# Altium project Softcore_SA_P2_HW.PrjPcb
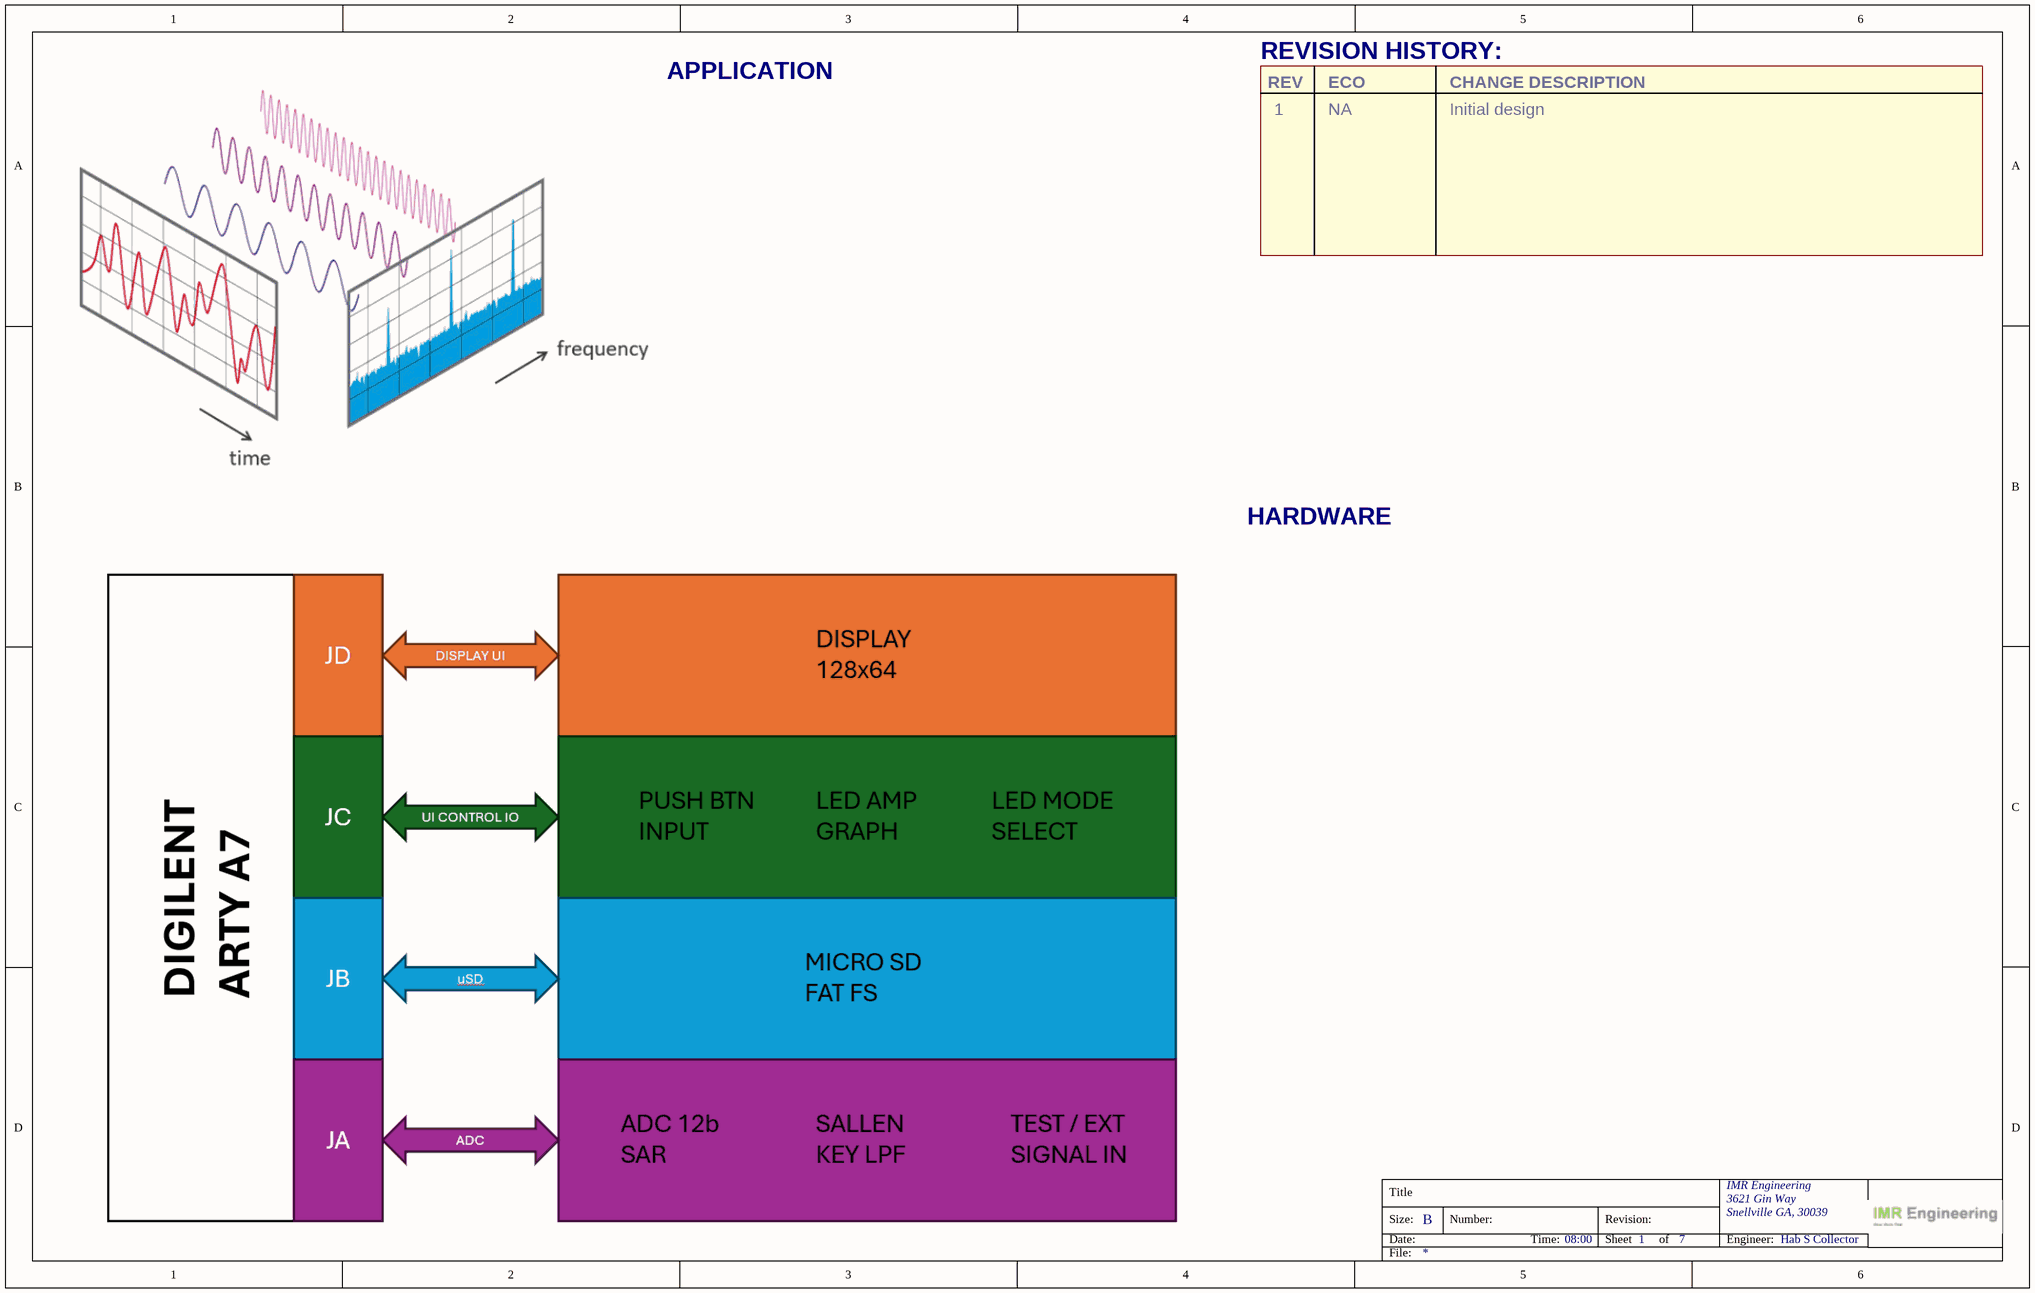
[diagram p0: SoftCore_SA_P2_PG1.SchDoc]
ProjectDate: 05/11/2026; ProjectDocumentNumber: IMR-107-SCH; ProjectRevision: 1; ProjectTime: 08:00; ProjectTitle: SoftCore_SA P2 Adapter
7 sheets, 204 parts. Net scope: flat (ports and power ports of the same name join across sheets).
Sheets:
  SoftCore_SA_P2_PG1.SchDoc
  SoftCore_SA_P2_PG2.SchDoc
  SoftCore_SA_P2_PG3.SchDoc
  SoftCore_SA_P2_PG4.SchDoc
  SoftCore_SA_P2_PG5.SchDoc
  SoftCore_SA_P2_PG6.SchDoc
  SoftCore_SA_P2_PG7.SchDoc

## Sheet SoftCore_SA_P2_PG1.SchDoc: =ProjectTitle
size B; Date: 05/11/2026; Engineer: Hab S Collector; Address1: 3621 Gin Way; Address2: Snellville GA, 30039; DocumentNumber: IMR-107-SCH; Revision: 1; SheetNumber: 1; SheetTotal: 7

### Notes on the sheet
- APPLICATION
- REVISION HISTORY:
- REV
- ECO
- CHANGE DESCRIPTION
- 1
- NA
- Initial design
- HARDWARE
- Title
- Size:
- Date:
- B
- Number:
- Time:
- Revision:
- Sheet
- of
- IMR Engineering
- Engineer:
- File:

## Sheet SoftCore_SA_P2_PG2.SchDoc: =ProjectTitle
size B; Date: 05/11/2026; Engineer: Hab S Collector; Address1: 3621 Gin Way; Address2: Snellville GA, 30039; DocumentNumber: IMR-107-SCH; Revision: 1; SheetNumber: 2; SheetTotal: 7
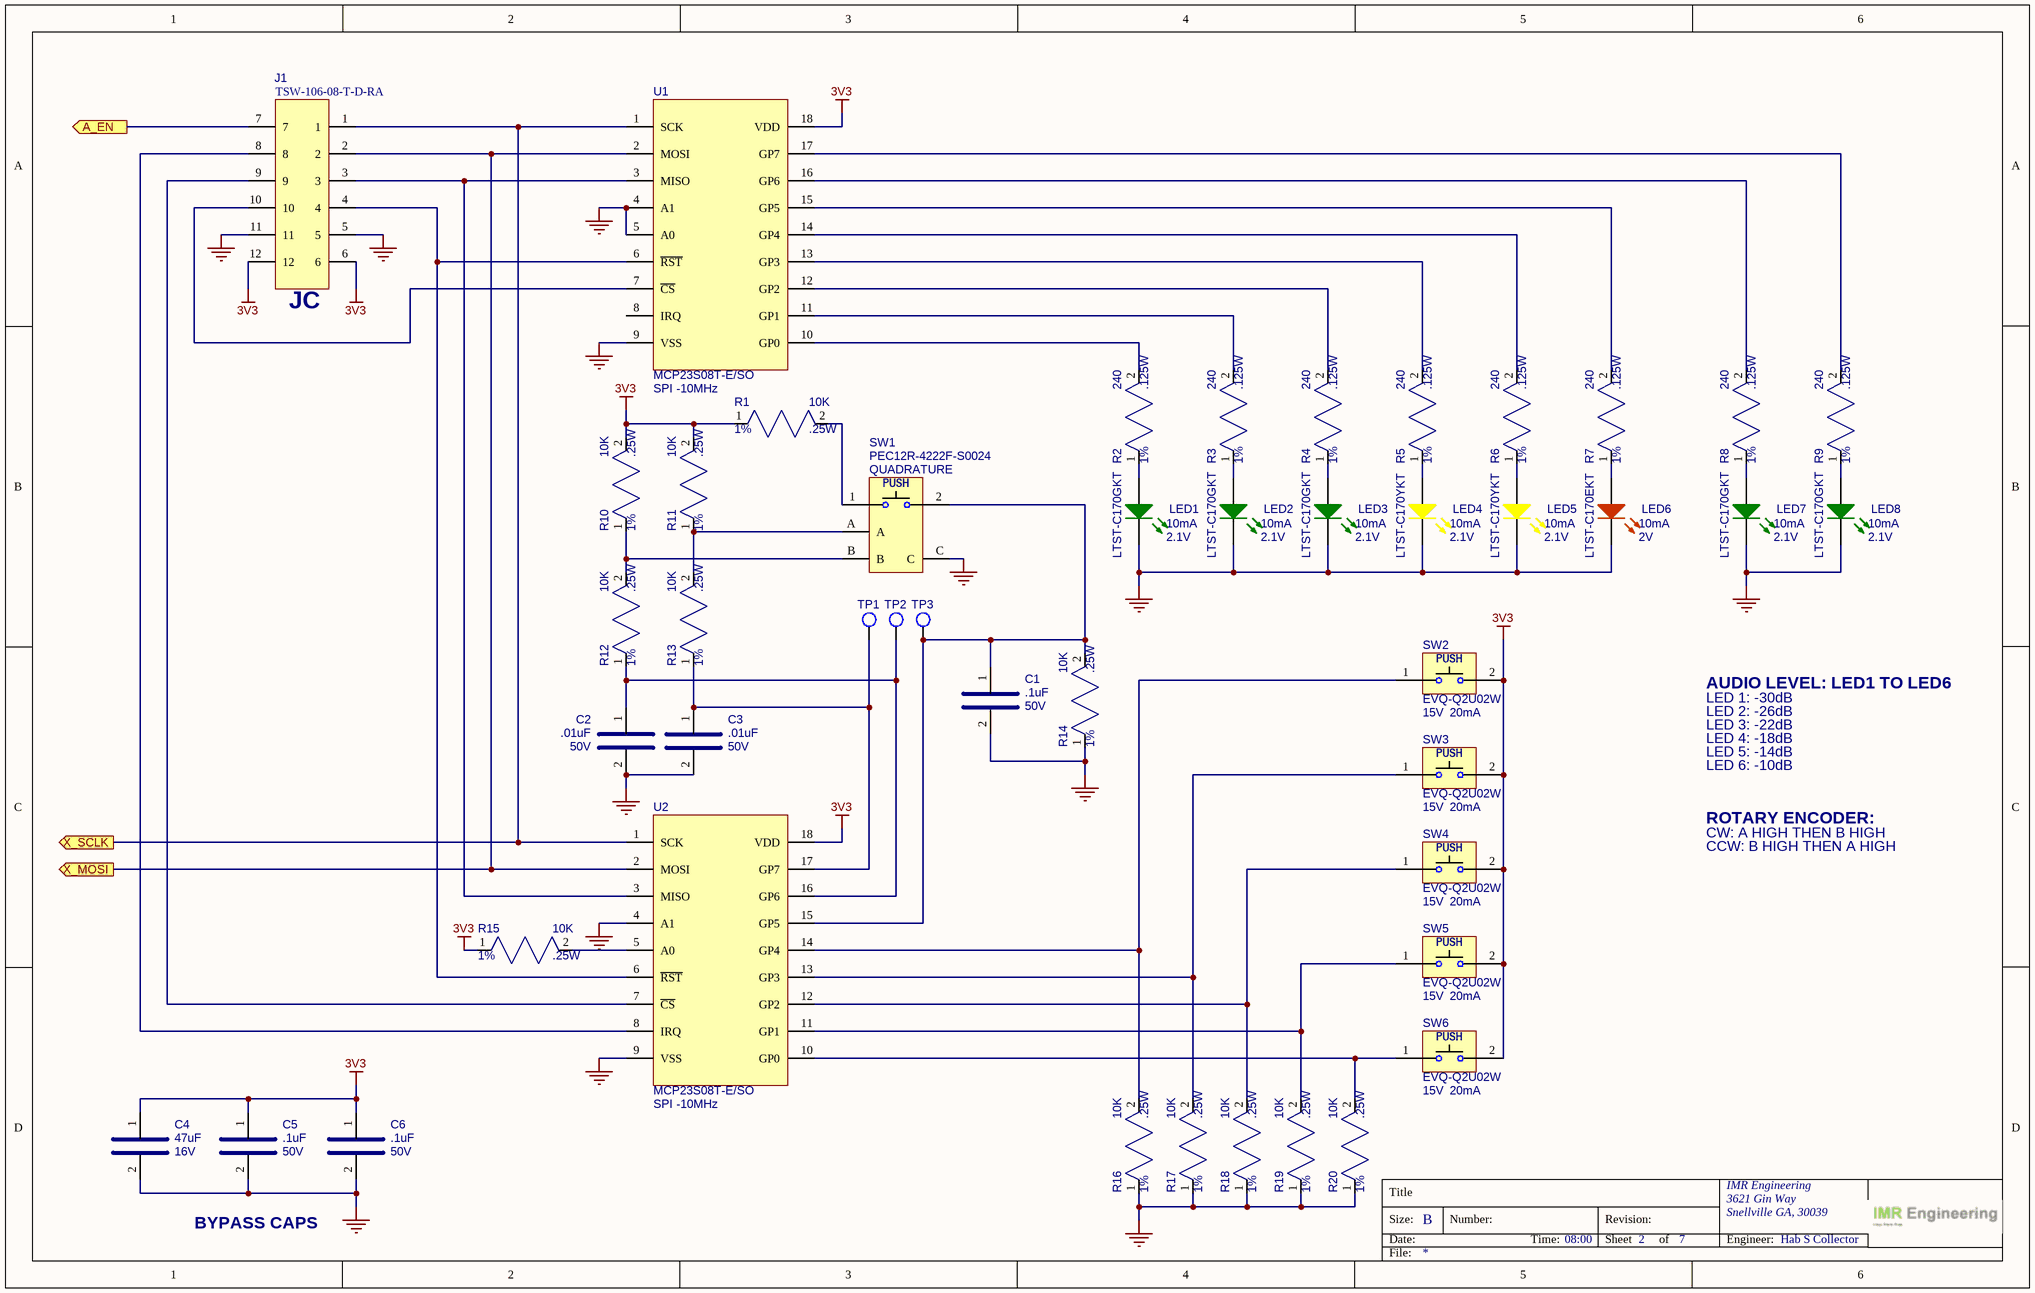
[diagram p1: SoftCore_SA_P2_PG2.SchDoc]

### Parts
C1  value .1uF  Voltage: 50V  [CAP_0805]  (hidden comment: KGM21NR71H104KT)
C2  value .01uF  Voltage: 50V  [CAP_0805]  (hidden comment: KGM21NR71H103KT)
C3  value .01uF  Voltage: 50V  [CAP_0805]  (hidden comment: KGM21NR71H103KT)
C4  value 47uF  Voltage: 16V  [CAP_1210]  (hidden comment: GRM32ER60J476ME20L)
C5  value .1uF  Voltage: 50V  [CAP_0805]  (hidden comment: KGM21NR71H104KT)
C6  value .1uF  Voltage: 50V  [CAP_0805]  (hidden comment: KGM21NR71H104KT)
J1  TSW-106-08-T-D-RA  [SAMTEC_TSW-106-08-T-D-RA]
LED1  value 2.1V  Current: 10mA  [LED_0805]  (hidden comment: LTST-C170GKT)
LED2  value 2.1V  Current: 10mA  [LED_0805]  (hidden comment: LTST-C170GKT)
LED3  value 2.1V  Current: 10mA  [LED_0805]  (hidden comment: LTST-C170GKT)
LED4  value 2.1V  Current: 10mA  [LED_0805]  (hidden comment: LTST-C170YKT)
LED5  value 2.1V  Current: 10mA  [LED_0805]  (hidden comment: LTST-C170YKT)
LED6  value 2V  Current: 10mA  [LED_0805]  (hidden comment: LTST-C170EKT)
LED7  value 2.1V  Current: 10mA  [LED_0805]  (hidden comment: LTST-C170GKT)
LED8  value 2.1V  Current: 10mA  [LED_0805]  (hidden comment: LTST-C170GKT)
R1  value 10K  Power: .25W  Tolerance: 1%  [RES_0805]  (hidden comment: RC0805FR-7W10KL)
R2  value 240  Power: .125W  Tolerance: 1%  [RES_0805]  (hidden comment: RC0805FR-13240RL)
R3  value 240  Power: .125W  Tolerance: 1%  [RES_0805]  (hidden comment: RC0805FR-13240RL)
R4  value 240  Power: .125W  Tolerance: 1%  [RES_0805]  (hidden comment: RC0805FR-13240RL)
R5  value 240  Power: .125W  Tolerance: 1%  [RES_0805]  (hidden comment: RC0805FR-13240RL)
R6  value 240  Power: .125W  Tolerance: 1%  [RES_0805]  (hidden comment: RC0805FR-13240RL)
R7  value 240  Power: .125W  Tolerance: 1%  [RES_0805]  (hidden comment: RC0805FR-13240RL)
R8  value 240  Power: .125W  Tolerance: 1%  [RES_0805]  (hidden comment: RC0805FR-13240RL)
R9  value 240  Power: .125W  Tolerance: 1%  [RES_0805]  (hidden comment: RC0805FR-13240RL)
R10  value 10K  Power: .25W  Tolerance: 1%  [RES_0805]  (hidden comment: RC0805FR-7W10KL)
R11  value 10K  Power: .25W  Tolerance: 1%  [RES_0805]  (hidden comment: RC0805FR-7W10KL)
R12  value 10K  Power: .25W  Tolerance: 1%  [RES_0805]  (hidden comment: RC0805FR-7W10KL)
R13  value 10K  Power: .25W  Tolerance: 1%  [RES_0805]  (hidden comment: RC0805FR-7W10KL)
R14  value 10K  Power: .25W  Tolerance: 1%  [RES_0805]  (hidden comment: RC0805FR-7W10KL)
R15  value 10K  Power: .25W  Tolerance: 1%  [RES_0805]  (hidden comment: RC0805FR-7W10KL)
R16  value 10K  Power: .25W  Tolerance: 1%  [RES_0805]  (hidden comment: RC0805FR-7W10KL)
R17  value 10K  Power: .25W  Tolerance: 1%  [RES_0805]  (hidden comment: RC0805FR-7W10KL)
R18  value 10K  Power: .25W  Tolerance: 1%  [RES_0805]  (hidden comment: RC0805FR-7W10KL)
R19  value 10K  Power: .25W  Tolerance: 1%  [RES_0805]  (hidden comment: RC0805FR-7W10KL)
R20  value 10K  Power: .25W  Tolerance: 1%  [RES_0805]  (hidden comment: RC0805FR-7W10KL)
SW1  Output: QUADRATURE  [PEC12R-4222F-S0024]  (hidden comment: PEC12R-4222F-S0024)
SW2  value 15V  Current: 20mA  [PANASONIC_EVQ-Q2U02W]  (hidden comment: EVQ-Q2U02W)
SW3  value 15V  Current: 20mA  [PANASONIC_EVQ-Q2U02W]  (hidden comment: EVQ-Q2U02W)
SW4  value 15V  Current: 20mA  [PANASONIC_EVQ-Q2U02W]  (hidden comment: EVQ-Q2U02W)
SW5  value 15V  Current: 20mA  [PANASONIC_EVQ-Q2U02W]  (hidden comment: EVQ-Q2U02W)
SW6  value 15V  Current: 20mA  [PANASONIC_EVQ-Q2U02W]  (hidden comment: EVQ-Q2U02W)
TP1  (no value)  [TEST_POINT_35MIL_TH]  (no BOM)
TP2  (no value)  [TEST_POINT_35MIL_TH]  (no BOM)
TP3  (no value)  [TEST_POINT_35MIL_TH]  (no BOM)
U1  value SPI -10MHz  [SOIC-18_300]  (hidden comment: MCP23S08T-E/SO)
U2  value SPI -10MHz  [SOIC-18_300]  (hidden comment: MCP23S08T-E/SO)

### Ports
A_EN (out), X_MOSI (out), X_SCLK (out)

### Nets
3V3: C4.1 C5.1 C6.1 J1.6 J1.12 R1.1 R10.2 R11.2 R15.1 SW2.2(B') SW3.2(B') SW4.2(B') SW5.2(B') SW6.2(B') U1.18(VDD) U2.18(VDD)
GND: C1.2 C2.2 C3.2 C4.2 C5.2 C6.2 J1.5 J1.11 LED1.K LED2.K LED3.K LED4.K LED5.K LED6.K LED7.K LED8.K R14.1 R16.1 R17.1 R18.1 R19.1 R20.1 SW1.C U1.4(A1) U1.5(A0) U1.9(VSS) U2.4(A1) U2.9(VSS)
NetC1_1: C1.1 R14.2 SW1.2(B') TP3.1 U2.15(GP5)
NetC2_1: C2.1 R12.1 TP2.1 U2.16(GP6)
NetC3_1: C3.1 R13.1 TP1.1 U2.17(GP7)
NetJ1_1: J1.1 U1.1(SCK) U2.1(SCK) ; port X_SCLK
NetJ1_2: J1.2 U1.2(MOSI) U2.2(MOSI) ; port X_MOSI
NetJ1_3: J1.3 U1.3(MISO) U2.3(MISO)
NetJ1_4: J1.4 U1.6(~{RST}) U2.6(~{RST})
NetJ1_7: J1.7 ; port A_EN
NetJ1_8: J1.8 U2.8(IRQ)
NetJ1_9: J1.9 U2.7(~{CS})
NetJ1_10: J1.10 U1.7(~{CS})
NetLED1_A: LED1.A R2.1
NetLED2_A: LED2.A R3.1
NetLED3_A: LED3.A R4.1
NetLED4_A: LED4.A R5.1
NetLED5_A: LED5.A R6.1
NetLED6_A: LED6.A R7.1
NetLED7_A: LED7.A R8.1
NetLED8_A: LED8.A R9.1
NetR1_2: R1.2 SW1.1(B)
NetR2_2: R2.2 U1.10(GP0)
NetR3_2: R3.2 U1.11(GP1)
NetR4_2: R4.2 U1.12(GP2)
NetR5_2: R5.2 U1.13(GP3)
NetR6_2: R6.2 U1.14(GP4)
NetR7_2: R7.2 U1.15(GP5)
NetR8_2: R8.2 U1.16(GP6)
NetR9_2: R9.2 U1.17(GP7)
NetR10_1: R10.1 R12.2 SW1.B
NetR11_1: R11.1 R13.2 SW1.A
NetR15_2: R15.2 U2.5(A0)
NetR16_2: R16.2 SW2.1(B) U2.14(GP4)
NetR17_2: R17.2 SW3.1(B) U2.13(GP3)
NetR18_2: R18.2 SW4.1(B) U2.12(GP2)
NetR19_2: R19.2 SW5.1(B) U2.11(GP1)
NetR20_2: R20.2 SW6.1(B) U2.10(GP0)

Not connected (* = marked no-connect by the designer): U1 8(IRQ)

### Notes on the sheet
- (near J1) JC
- AUDIO LEVEL: LED1 TO LED6
- LED 1: -30dB
- LED 2: -26dB
- LED 3: -22dB
- LED 4: -18dB
- LED 5: -14dB
- LED 6: -10dB
- ROTARY ENCODER:
- CW: A HIGH THEN B HIGH
- CCW: B HIGH THEN A HIGH
- BYPASS CAPS
- Title
- Size:
- Date:
- B
- Number:
- Time:
- Revision:
- Sheet
- of
- IMR Engineering
- Engineer:
- File:
- (in symbol SWITCH_EVQ-Q2U02W) PUSH
- (in symbol SWITCH_PEC12R-4222F-S0024) PUSH

### Library data of the parts
C1 C5 C6 = CAP_SMD_0.1UF_50V_0805: CAP CER 0.1UF 50V X7R 0805; MFG: KYOCERA AVX; Case/Package: 0805; MFG_PN: KGM21NR71H104KT; Supplier 1: DigiKey; Supplier Part Number 1: 478-KGM21NR71H104KTCT-ND; Unit Price: .1
C2 C3 = CAP_SMD_0.01UF_50V_0805: CAP CER 0.01UF 50V X7R 0805; MFG: KYOCERA AVX; Case/Package: 0805; MFG_PN: KGM21NR71H103KT; Supplier 1: DigiKey; Supplier Part Number 1: 478-KGM21NR71H103KTCT-ND; Unit Price: .1
C4 = CAP_SMD_47UF_16V_1210: CAP CER 47UF 50V X5R 1210; MFG: Murata Electronics; Case/Package: 1210; MFG_PN: GRM32ER60J476ME20L; Supplier 1: DigiKey; Supplier Part Number 1: 490-1887-1-ND; Unit Price: .28
J1 = CONN_HEADER_12P_100MIL_RA: CONN HEADER R/A 12POS 2.54MM; MFG: Samtec Inc.; Case/Package: 2P_2.54MM; Supplier 1: Digi-Key; Supplier Part Number 1: SAM1049-06-ND; Unit Price: .93; MFG_PN: TSW-106-08-T-D-RA
LED1-LED3 LED7 LED8 = LED_GREEN_LTST-C170GKT: LED GREEN CLEAR SMD; MFG: Lite-On; Case/Package: 0805; Supplier 1: DigiKey; Supplier Part Number 1: 160-1179-1-ND; Unit Price: .10; MFG_PN: LTST-C170GKT
LED4 LED5 = LED_YELLOW_LTST-C170YKT: LED YELLOW CLEAR SMD; MFG: Lite-On; Case/Package: 0805; Supplier 1: DigiKey; Supplier Part Number 1: 160-1175-1-ND; Unit Price: .15; MFG_PN: LTST-C170YKT
LED6 = LED_RED_LTST-C170EKT: LED RED CLEAR SMD; MFG: Lite-On; Case/Package: 0805; Supplier 1: DigiKey; Supplier Part Number 1: 160-1178-1-ND; Unit Price: .18; MFG_PN: LTST-C170EKT
R1 R10-R20 = RES_SMD_10K_0805_1/4W_1%: RES SMD 10K OHM 1% 1/4W 0805; MFG: Yageo; Case/Package: 0805; MFG_PN: RC0805FR-7W10KL; Supplier 1: DigiKey; Supplier Part Number 1: 13-RC0805FR-7W10KLCT-ND; Unit Price: .10
R2-R9 = RES_SMD_240_0805_1/8W_1%: RES SMD 240 OHM 1% 1/8W 0805; MFG: Yageo; Case/Package: 0805; MFG_PN: RC0805FR-13240RL; Supplier 1: DigiKey; Supplier Part Number 1: 13-RC0805FR-13240RLCT-ND; Unit Price: .1
SW1 = SWITCH_PEC12R-4222F-S0024: ENCODER INCRE QUAD HORIZN PC PIN; MFG: Bourns; Pulses: 24; Case/Package: PEC12R; Supplier 1: DigiKey; Supplier Part Number 1: PEC12R-4222F-S0024-ND; Unit Price: 1.72; MFG_PN: PEC12R-4222F-S0024
SW2-SW6 = SWITCH_EVQ-Q2U02W: SWITCH TACTILE SPST-NO 0.02A 15V; MFG: American Zettler; Case/Package: EVQQ2; Supplier 1: DigiKey; Supplier Part Number 1: P12954SCT-ND; Unit Price: .25; MFG_PN: EVQ-Q2U02W
TP1-TP3 = CONN_TEST_POINT_TH_PROBE_TIP: TEST POINT TH FITS DSO PROBE TIP
U1 U2 = IC_MCP23S08T-E/SO: IC IO XPNDR 10MHZ SPI 18SOIC; MFG: Microchip; Case/Package: SOIC-18-300; Supplier 1: DigiKey; Supplier Part Number 1: MCP23S08T-E/SOCT-ND; Unit Price: 1.54; MFG_PN: MCP23S08T-E/SO

## Sheet SoftCore_SA_P2_PG3.SchDoc: =ProjectTitle
size B; Date: 05/11/2026; Engineer: Hab S Collector; Address1: 3621 Gin Way; Address2: Snellville GA, 30039; DocumentNumber: IMR-107-SCH; Revision: 1; SheetNumber: 3; SheetTotal: 7
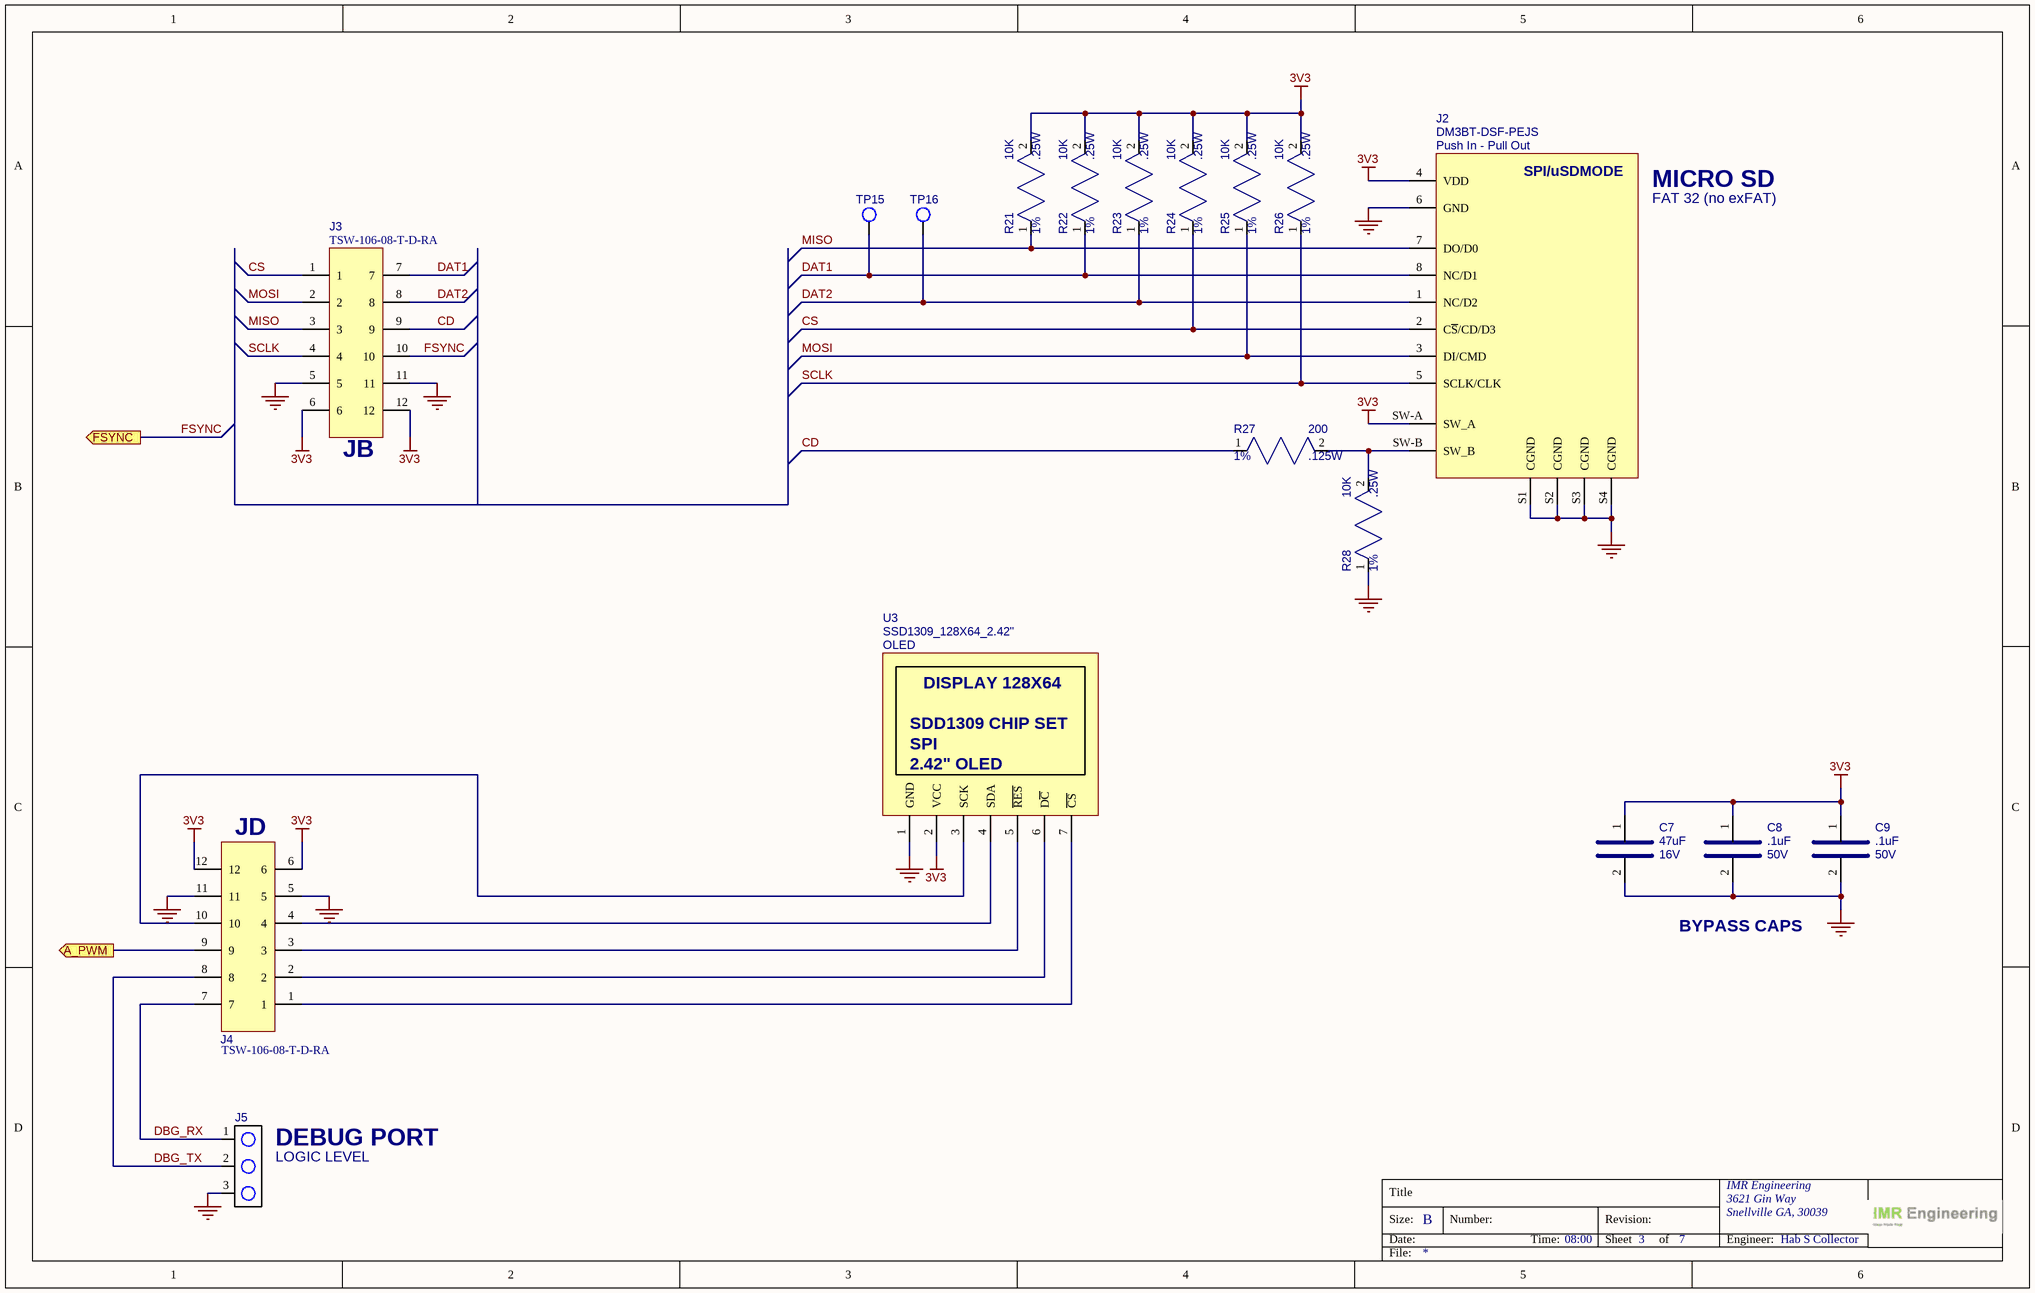
[diagram p2: SoftCore_SA_P2_PG3.SchDoc]

### Parts
C7  value 47uF  Voltage: 16V  [CAP_1210]  (hidden comment: GRM32ER60J476ME20L)
C8  value .1uF  Voltage: 50V  [CAP_0805]  (hidden comment: KGM21NR71H104KT)
C9  value .1uF  Voltage: 50V  [CAP_0805]  (hidden comment: KGM21NR71H104KT)
J2  value Push In - Pull Out  [HRS_DM3BT-DSF-PEJS]  (hidden comment: DM3BT-DSF-PEJS)
J3  TSW-106-08-T-D-RA  [SAMTEC_TSW-106-08-T-D-RA]
J4  TSW-106-08-T-D-RA  [SAMTEC_TSW-106-08-T-D-RA]
J5  PREC003SFAN-RC  [HDR_1X3_100MILL]  (value not drawn)
R21  value 10K  Power: .25W  Tolerance: 1%  [RES_0805]  (hidden comment: RC0805FR-7W10KL)
R22  value 10K  Power: .25W  Tolerance: 1%  [RES_0805]  (hidden comment: RC0805FR-7W10KL)
R23  value 10K  Power: .25W  Tolerance: 1%  [RES_0805]  (hidden comment: RC0805FR-7W10KL)
R24  value 10K  Power: .25W  Tolerance: 1%  [RES_0805]  (hidden comment: RC0805FR-7W10KL)
R25  value 10K  Power: .25W  Tolerance: 1%  [RES_0805]  (hidden comment: RC0805FR-7W10KL)
R26  value 10K  Power: .25W  Tolerance: 1%  [RES_0805]  (hidden comment: RC0805FR-7W10KL)
R27  value 200  Power: .125W  Tolerance: 1%  [RES_0805]  (hidden comment: RC0805FR-07200RL)
R28  value 10K  Power: .25W  Tolerance: 1%  [RES_0805]  (hidden comment: RC0805FR-7W10KL)
TP15  (no value)  [TEST_POINT_35MIL_TH]  (no BOM)
TP16  (no value)  [TEST_POINT_35MIL_TH]  (no BOM)
U3  TYPE: OLED  [MODULE_DISPLAY_128X64_2.42]  (hidden comment: SSD1309_128X64_2.42")

### Ports
A_PWM (out), FSYNC (out)

### Nets
3V3: C7.1 C8.1 C9.1 J2.4(VDD) J2.SW-A(SW_A) J3.6 J3.12 J4.6 J4.12 R21.2 R22.2 R23.2 R24.2 R25.2 R26.2 U3.2(VCC)
GND: C7.2 C8.2 C9.2 J2.6(GND) J2.S1(CGND) J2.S2(CGND) J2.S3(CGND) J2.S4(CGND) J3.5 J3.11 J4.5 J4.11 J5.3 R28.1 U3.1(GND)
CD: J3.9 R27.1
CS: J2.2(C~{S}/CD/D3) J3.1 R24.1
DAT1: J2.8(NC/D1) J3.7 R22.1 TP15.1
DAT2: J2.1(NC/D2) J3.8 R23.1 TP16.1
DBG_RX: J4.7 J5.1
DBG_TX: J4.8 J5.2
FSYNC: J3.10 ; port FSYNC
MISO: J2.7(DO/D0) J3.3 R21.1
MOSI: J2.3(DI/CMD) J3.2 R25.1
SCLK: J2.5(SCLK/CLK) J3.4 R26.1
NetC29_2: J4.9 ; port A_PWM
NetJ2_SW-B: J2.SW-B(SW_B) R27.2 R28.2
NetJ4_1: J4.1 U3.7(~{CS})
NetJ4_2: J4.2 U3.6(D~{C})
NetJ4_3: J4.3 U3.5(~{RES})
NetJ4_4: J4.4 U3.4(SDA)
NetJ4_10: J4.10 U3.3(SCK)

### Notes on the sheet
- (near J2) MICRO SD
- (near J2) FAT 32 (no exFAT)
- (near J3) JB
- (near J4) JD
- BYPASS CAPS
- (near J5) DEBUG PORT
- (near J5) LOGIC LEVEL
- Title
- Size:
- Date:
- B
- Number:
- Time:
- Revision:
- Sheet
- of
- IMR Engineering
- Engineer:
- File:
- (in symbol CONN_MICRO-SD_DM3BT-DSF-PEJS) SPI/uSDMODE
- (in symbol MODULE_DISPLAY_128X64_2.42) DISPLAY 128X64; SDD1309 CHIP SET; SPI; 2.42" OLED

### Library data of the parts
C7 = CAP_SMD_47UF_16V_1210: as C4 on sheet SoftCore_SA_P2_PG2; Case/Package: 1210; MFG_PN: GRM32ER60J476ME20L; Supplier 1: DigiKey; Supplier Part Number 1: 490-1887-1-ND; Unit Price: .28
C8 C9 = CAP_SMD_0.1UF_50V_0805: as C1 on sheet SoftCore_SA_P2_PG2; Case/Package: 0805; MFG_PN: KGM21NR71H104KT; Supplier 1: DigiKey; Supplier Part Number 1: 478-KGM21NR71H104KTCT-ND; Unit Price: .1
J2 = CONN_MICRO-SD_DM3BT-DSF-PEJS: CONN MICRO SD CARD R/A SMD; MFG: Hirose Electric Co Ltd; Case/Package: DM3BT-DSF-PEJS; Supplier 1: DigiKey; Supplier Part Number 1: HR1942CT-ND; Unit Price: 2.30; MFG_PN: DM3BT-DSF-PEJS
J3 J4 = CONN_HEADER_12P_100MIL_RA: as J1 on sheet SoftCore_SA_P2_PG2; Case/Package: 2P_2.54MM; Supplier 1: Digi-Key; Supplier Part Number 1: SAM1049-06-ND; Unit Price: .93; MFG_PN: TSW-106-08-T-D-RA
J5 = CONN_HEADER_3P_100MIL_VERT: CONN HEADER VERT 3POS 2.54MM; MFG: Sullins Connector Solutions; Case/Package: 2P_2.54MM; MFG_PN: PREC003SFAN-RC; Supplier 1: Digi-Key; Supplier Part Number 1: S1212EC-03-ND; Value: *; Unit Price: .07
R21-R26 R28 = RES_SMD_10K_0805_1/4W_1%: RES SMD 10K OHM 1% 1/4W 0805; MFG: Yageo; Case/Package: 0805; MFG_PN: RC0805FR-7W10KL; Supplier 1: DigiKey; Supplier Part Number 1: 13-RC0805FR-7W10KLCT-ND; Unit Price: .10
R27 = RES_SMD_200_0805_1/8W_1%: RES SMD 200 OHM 1% 1/8W 0805; MFG: Yageo; Case/Package: 0805; MFG_PN: RC0805FR-07200RL; Supplier 1: DigiKey; Supplier Part Number 1: 311-200CRCT-ND; Unit Price: .1
TP15 TP16 = CONN_TEST_POINT_TH_PROBE_TIP: TEST POINT TH FITS DSO PROBE TIP
U3 = MODULE_DISPLAY_128X64_2.42: DISPLAY 128X64 SSD1309 2.42" OLED WHITE; MFG: UNKNOWN; NOTES: This display is sold by several companies on Amazon - you can identify it by description and the back of the PCB - sellers: HiLetgo, Aceirmc; Case/Package: MODULE_DISPLAY_128X64_2.42; Supplier 1: Amazon; Supplier Part Number 1: SSD1309 2.42"; Unit Price: 16.99; Resolution: 128X64; MFG_PN: SSD1309_128X64_2.42"

## Sheet SoftCore_SA_P2_PG4.SchDoc: =ProjectTitle
size B; Date: 05/11/2026; Engineer: Hab S Collector; Address1: 3621 Gin Way; Address2: Snellville GA, 30039; DocumentNumber: IMR-107-SCH; Revision: 1; SheetNumber: 4; SheetTotal: 7
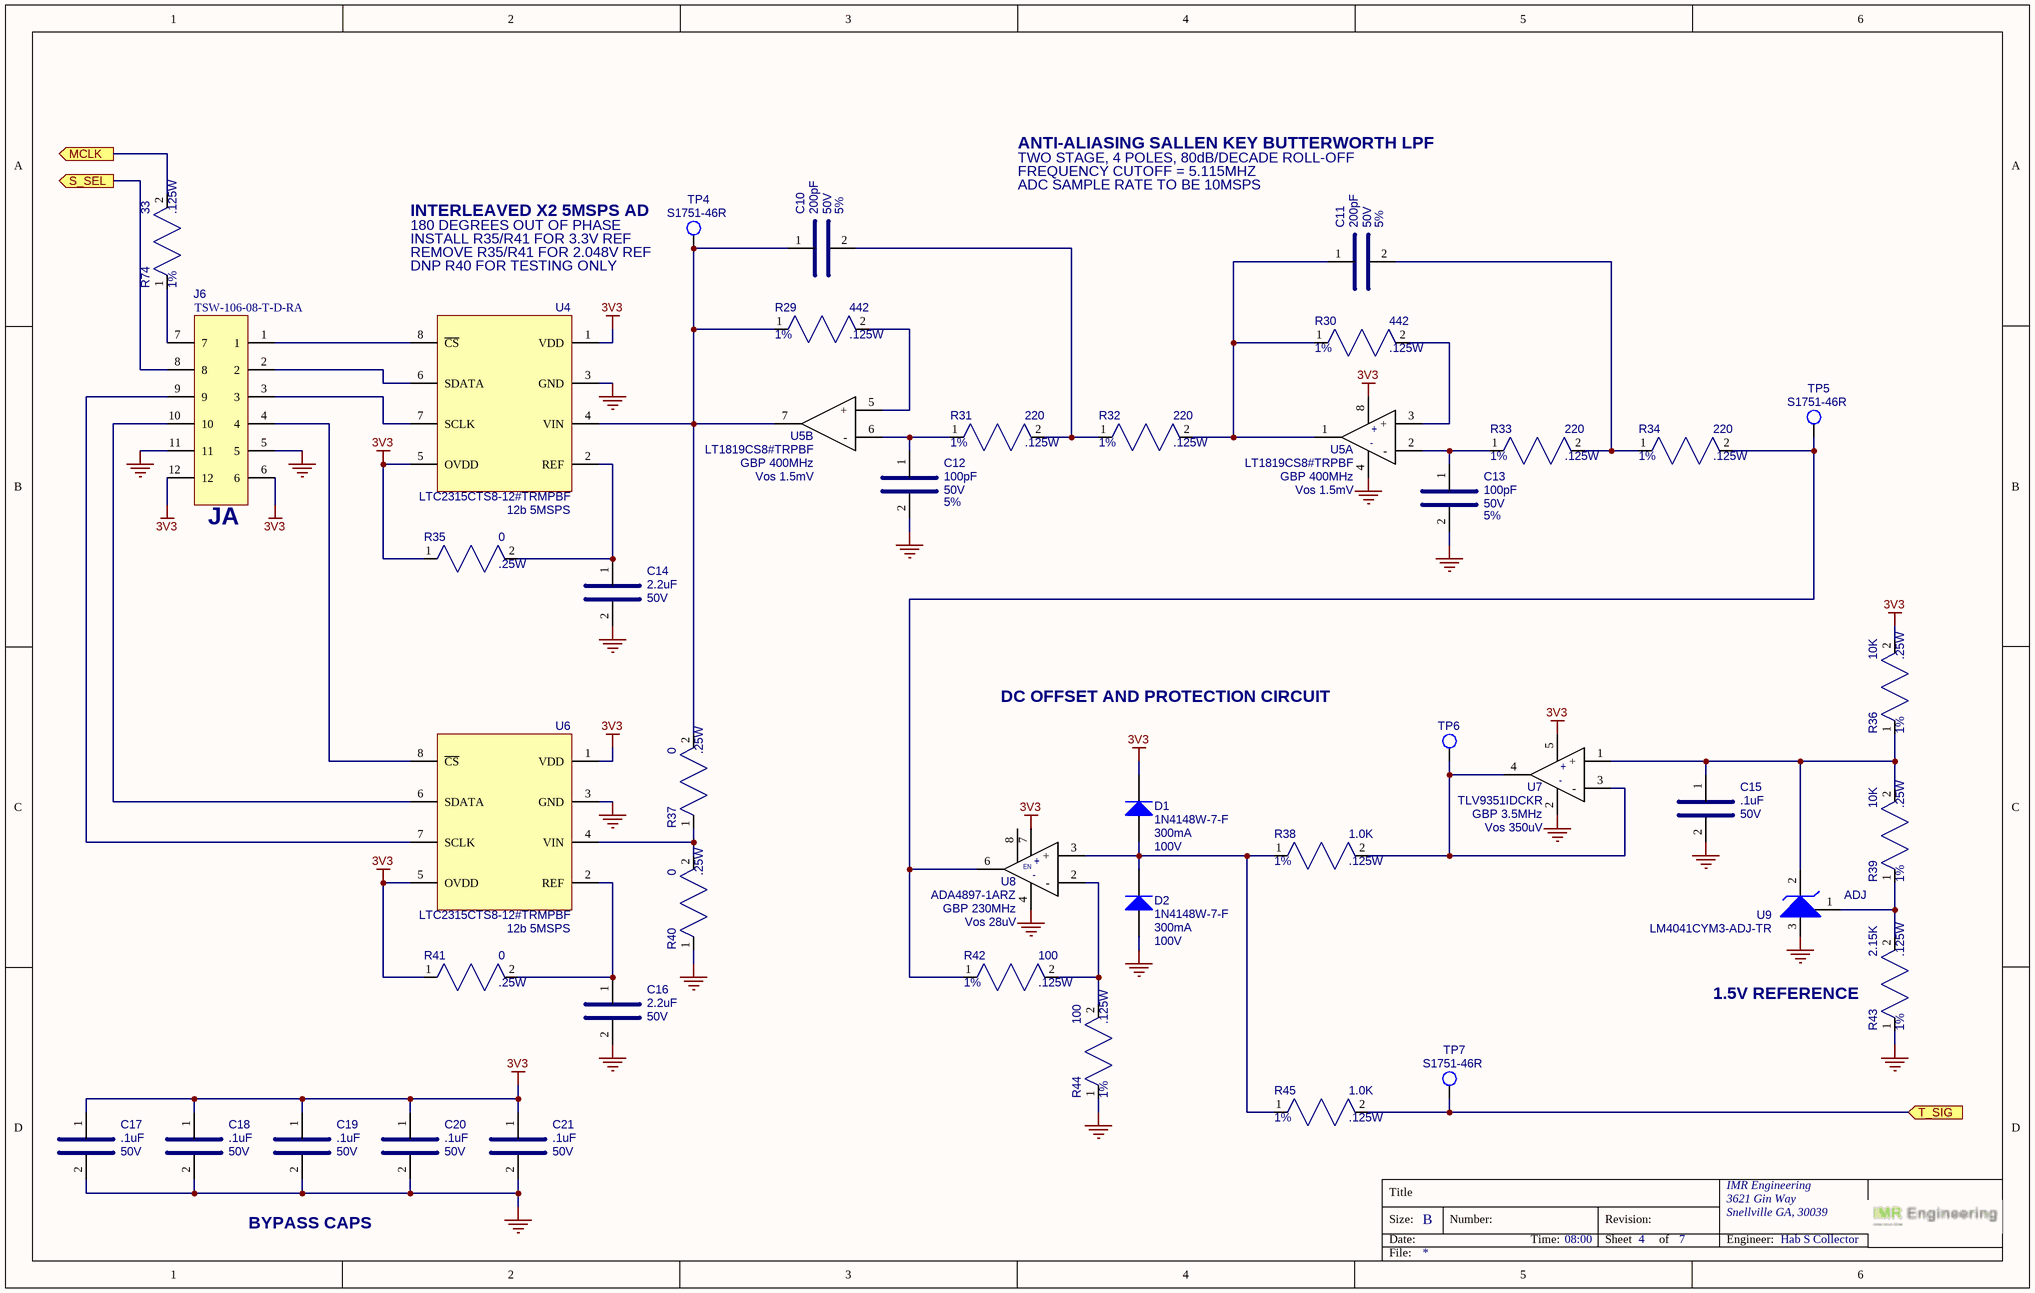
[diagram p3: SoftCore_SA_P2_PG4.SchDoc]

### Parts
C10  value 200pF  Voltage: 50V  Tolerance: 5%  [CAP_0805]  (hidden comment: C0805C201J5RACAUTO)
C11  value 200pF  Voltage: 50V  Tolerance: 5%  [CAP_0805]  (hidden comment: C0805C201J5RACAUTO)
C12  value 100pF  Voltage: 50V  Tolerance: 5%  [CAP_0805]  (hidden comment: C0805C101J5RACAUTO)
C13  value 100pF  Voltage: 50V  Tolerance: 5%  [CAP_0805]  (hidden comment: C0805C101J5RACAUTO)
C14  value 2.2uF  Voltage: 50V  [CAP_0805]  (hidden comment: GRM219R61E225KA12J)
C15  value .1uF  Voltage: 50V  [CAP_0805]  (hidden comment: KGM21NR71H104KT)
C16  value 2.2uF  Voltage: 50V  [CAP_0805]  (hidden comment: GRM219R61E225KA12J)
C17  value .1uF  Voltage: 50V  [CAP_0805]  (hidden comment: KGM21NR71H104KT)
C18  value .1uF  Voltage: 50V  [CAP_0805]  (hidden comment: KGM21NR71H104KT)
C19  value .1uF  Voltage: 50V  [CAP_0805]  (hidden comment: KGM21NR71H104KT)
C20  value .1uF  Voltage: 50V  [CAP_0805]  (hidden comment: KGM21NR71H104KT)
C21  value .1uF  Voltage: 50V  [CAP_0805]  (hidden comment: KGM21NR71H104KT)
D1  value 100V  Current: 300mA  [SOD123]  (hidden comment: 1N4148W-7-F)
D2  value 100V  Current: 300mA  [SOD123]  (hidden comment: 1N4148W-7-F)
J6  TSW-106-08-T-D-RA  [SAMTEC_TSW-106-08-T-D-RA]
R29  value 442  Power: .125W  Tolerance: 1%  [RES_0805]  (hidden comment: RC0805FR-07442RL)
R30  value 442  Power: .125W  Tolerance: 1%  [RES_0805]  (hidden comment: RC0805FR-07442RL)
R31  value 220  Power: .125W  Tolerance: 1%  [RES_0805]  (hidden comment: RC0805FR-07220RL)
R32  value 220  Power: .125W  Tolerance: 1%  [RES_0805]  (hidden comment: RC0805FR-07220RL)
R33  value 220  Power: .125W  Tolerance: 1%  [RES_0805]  (hidden comment: RC0805FR-07220RL)
R34  value 220  Power: .125W  Tolerance: 1%  [RES_0805]  (hidden comment: RC0805FR-07220RL)
R35  value 0  Power: .25W  [RES_0805]  (hidden comment: RC0805JR-070RL)
R36  value 10K  Power: .25W  Tolerance: 1%  [RES_0805]  (hidden comment: RC0805FR-7W10KL)
R37  value 0  Power: .25W  [RES_0805]  (hidden comment: RC0805JR-070RL)
R38  value 1.0K  Power: .125W  Tolerance: 1%  [RES_0805]  (hidden comment: RC0805FR-071KL)
R39  value 10K  Power: .25W  Tolerance: 1%  [RES_0805]  (hidden comment: RC0805FR-7W10KL)
R40  value 0  Power: .25W  [RES_0805]  (hidden comment: RC0805JR-070RL)
R41  value 0  Power: .25W  [RES_0805]  (hidden comment: RC0805JR-070RL)
R42  value 100  Power: .125W  Tolerance: 1%  [RES_0805]  (hidden comment: RC0805FR-07100RL)
R43  value 2.15K  Power: .125W  Tolerance: 1%  [RES_0805]  (hidden comment: RC0805FR-072K15L)
R44  value 100  Power: .125W  Tolerance: 1%  [RES_0805]  (hidden comment: RC0805FR-07100RL)
R45  value 1.0K  Power: .125W  Tolerance: 1%  [RES_0805]  (hidden comment: RC0805FR-071KL)
R74  value 33  Power: .125W  Tolerance: 1%  [RES_0805]  (hidden comment: 311-33.0CRCT-ND)
TP4  S1751-46R  [HARWIN_S1751]
TP5  S1751-46R  [HARWIN_S1751]
TP6  (no value)  [TEST_POINT_35MIL_TH]  (no BOM)
TP7  S1751-46R  [HARWIN_S1751]
U4  value 12b 5MSPS  [SOT65P280X100-8N]  (hidden comment: LTC2315CTS8-12#TRMPBF)
U5  value GBP 400MHz  Vos: Vos 1.5mV  [SO-8_S_LIT]  (hidden comment: LT1819CS8#TRPBF)  (parts A,B of 2)
U6  value 12b 5MSPS  [SOT65P280X100-8N]  (hidden comment: LTC2315CTS8-12#TRMPBF)
U7  value GBP 3.5MHz  Vos: Vos 350uV  [SOT-353]  (hidden comment: TLV9351IDCKR)
U8  value GBP 230MHz  Vos: Vos 28uV  [R_8_ADI]  (hidden comment: ADA4897-1ARZ)
U9  value ADJ  [SOT-23]  (hidden comment: LM4041CYM3-ADJ-TR)

### Ports
MCLK (out), S_SEL (out), T_SIG (in)

### Nets
3V3: C17.1 C18.1 C19.1 C20.1 C21.1 D1.2(K) J6.6 J6.12 R35.1 R36.2 R41.1 U4.1(VDD) U4.5(OVDD) U5.8 U6.1(VDD) U6.5(OVDD) U7.5 U8.7
GND: C12.2 C13.2 C14.2 C15.2 C16.2 C17.2 C18.2 C19.2 C20.2 C21.2 D2.1(A) J6.5 J6.11 R40.1 R43.1 R44.1 U4.3(GND) U5.4 U6.3(GND) U7.2 U8.4 U9.3(A)
NetC10_1: C10.1 R29.1 R37.2 TP4.1 U4.4(VIN) U5.7
NetC10_2: C10.2 R31.2 R32.1
NetC11_1: C11.1 R30.1 R32.2 U5.1
NetC11_2: C11.2 R33.2 R34.1
NetC12_1: C12.1 R31.1 U5.6(-)
NetC13_1: C13.1 R33.1 U5.2(-)
NetC14_1: C14.1 R35.2 U4.2(REF)
NetC15_1: C15.1 R36.1 R39.2 U7.1(+) U9.2(K)
NetC16_1: C16.1 R41.2 U6.2(REF)
NetD1_1: D1.1(A) D2.2(K) R38.1 R45.1 U8.3(+)
NetJ6_1: J6.1 U4.8(~{CS})
NetJ6_2: J6.2 U4.6(SDATA)
NetJ6_3: J6.3 U4.7(SCLK)
NetJ6_4: J6.4 U6.8(~{CS})
NetJ6_7: J6.7 R74.1
NetJ6_8: J6.8 ; port S_SEL
NetJ6_9: J6.9 U6.7(SCLK)
NetJ6_10: J6.10 U6.6(SDATA)
NetR29_2: R29.2 U5.5(+)
NetR30_2: R30.2 U5.3(+)
NetR34_2: R34.2 R42.1 TP5.1 U8.6
NetR37_1: R37.1 R40.2 U6.4(VIN)
NetR38_2: R38.2 TP6.1 U7.3(-) U7.4
NetR39_1: R39.1 R43.2 U9.1(FB)
NetR42_2: R42.2 R44.2 U8.2(-)
NetR45_2: R45.2 TP7.1 ; port T_SIG
NetR74_2: R74.2 ; port MCLK

Not connected (* = marked no-connect by the designer): U8 8

### Notes on the sheet
- ANTI-ALIASING SALLEN KEY BUTTERWORTH LPF
- TWO STAGE, 4 POLES, 80dB/DECADE ROLL-OFF
- INTERLEAVED X2 5MSPS AD
- 180 DEGREES OUT OF PHASE
- FREQUENCY CUTOFF = 5.115MHZ
- ADC SAMPLE RATE TO BE 10MSPS
- INSTALL R35/R41 FOR 3.3V REF
- REMOVE R35/R41 FOR 2.048V REF
- DNP R40 FOR TESTING ONLY
- (near J6) JA
- DC OFFSET AND PROTECTION CIRCUIT
- 1.5V REFERENCE
- BYPASS CAPS
- Title
- Size:
- Date:
- B
- Number:
- Time:
- Revision:
- Sheet
- of
- IMR Engineering
- Engineer:
- File:
- (in symbol IC_OPAMP_ADA4897-1ARZ) EN

### Library data of the parts
C10 C11 = CAP_SMD_200PF_50V_0805: CAP CER 200PF 50V X7R 0805; MFG: KEMET; Case/Package: 0805; MFG_PN: C0805C201J5RACAUTO; Supplier 1: DigiKey; Supplier Part Number 1: 399-C0805C201J5RACAUTOCT-ND; Unit Price: .19
C12 C13 = CAP_SMD_100PF_50V_0805: CAP CER 100PF 50V X7R 0805; MFG: KEMET; Case/Package: 0805; MFG_PN: C0805C101J5RACAUTO; Supplier 1: DigiKey; Supplier Part Number 1: 399-17614-1-ND; Unit Price: .17
C14 C16 = CAP_SMD_2.2UF_50V_0805: CAP CER 2.2UF 50V X5R 0805; MFG: Murata Electronics; Case/Package: 0805; MFG_PN: GRM219R61E225KA12J; Supplier 1: DigiKey; Supplier Part Number 1: 490-GRM219R61E225KA12JCT-ND; Unit Price: .38
C15 C17-C21 = CAP_SMD_0.1UF_50V_0805: as C1 on sheet SoftCore_SA_P2_PG2; Case/Package: 0805; MFG_PN: KGM21NR71H104KT; Supplier 1: DigiKey; Supplier Part Number 1: 478-KGM21NR71H104KTCT-ND; Unit Price: .1
D1 D2 = DIODE_1N4148W-7-F: RELAY REED SPDT 250MA 5V; MFG: Diodes Inc; Case/Package: SOD-123; Supplier 1: DigiKey; Supplier Part Number 1: 1N4148W-FDICT-ND; Unit Price: .16; MFG_PN: 1N4148W-7-F
J6 = CONN_HEADER_12P_100MIL_RA: as J1 on sheet SoftCore_SA_P2_PG2; Case/Package: 2P_2.54MM; Supplier 1: Digi-Key; Supplier Part Number 1: SAM1049-06-ND; Unit Price: .93; MFG_PN: TSW-106-08-T-D-RA
R29 R30 = RES_SMD_442_0805_1/8W_1%: RES SMD 442 OHM 1% 1/8W 0805; MFG: Yageo; Case/Package: 0805; MFG_PN: RC0805FR-07442RL; Supplier 1: DigiKey; Supplier Part Number 1: 311-442CRCT-ND; Unit Price: .1
R31-R34 = RES_SMD_220_0805_1/8W_1%: RES SMD 220 OHM 1% 1/8W 0805; MFG: Yageo; Case/Package: 0805; MFG_PN: RC0805FR-07220RL; Supplier 1: DigiKey; Supplier Part Number 1: 311-220CRCT-ND; Unit Price: .1
R35 R37 R40 R41 = RES_SMD_0_0805_1/8W_1%: RES SMD 0 OHM 1% 1/8W 0805; MFG: Yageo; Case/Package: 0805; MFG_PN: RC0805JR-070RL; Supplier 1: DigiKey; Supplier Part Number 1: 311-0.0ARCT-ND; Unit Price: .1; Tolerance: 1%
R36 R39 = RES_SMD_10K_0805_1/4W_1%: RES SMD 10K OHM 1% 1/4W 0805; MFG: Yageo; Case/Package: 0805; MFG_PN: RC0805FR-7W10KL; Supplier 1: DigiKey; Supplier Part Number 1: 13-RC0805FR-7W10KLCT-ND; Unit Price: .10
R38 R45 = RES_SMD_1.0K_0805_1/8W_1%: RES SMD 1.0K OHM 1% 1/8W 0805; MFG: Yageo; Case/Package: 0805; MFG_PN: RC0805FR-071KL; Supplier 1: DigiKey; Supplier Part Number 1: 311-1.00KCRCT-ND; Unit Price: .1
R42 R44 = RES_SMD_100_0805_1/8W_1%: RES SMD 100 OHM 1% 1/8W 0805; MFG: Yageo; Case/Package: 0805; MFG_PN: RC0805FR-07100RL; Supplier 1: DigiKey; Supplier Part Number 1: 311-100CRCT-ND; Unit Price: .1
R43 = RES_SMD_2.15K_0805_1/8W_1%: RES SMD 2.15K OHM 1% 1/8W 0805; MFG: Yageo; Case/Package: 0805; MFG_PN: RC0805FR-072K15L; Supplier 1: DigiKey; Supplier Part Number 1: 311-2.15KCRCT-ND; Unit Price: .1
R74 = RES_SMD_33_0805_1/8W_1%: RES SMD 33K OHM 1% 1/8W 0805; MFG: Yageo; Case/Package: 0805; MFG_PN: 311-33.0CRCT-ND; Supplier 1: DigiKey; Supplier Part Number 1: 311-33.0CRCT-ND; Unit Price: .1
TP4 TP5 TP7 = CONN_TEST_POINT_S1751-46R: PCB TEST POINT CONNECT; MFG: Harwin Inc; Case/Package: S1751; Supplier 1: Digi-Key; Supplier Part Number 1: 952-1478-1-ND; Value: *; Unit Price: .28; MFG_PN: S1751-46R
TP6 = CONN_TEST_POINT_TH_PROBE_TIP: TEST POINT TH FITS DSO PROBE TIP
U4 U6 = IC_LTC2315CTS8-12#TRMPBF: IC ADC 12BIT SAR TSOT23-8; MFG: Analog Devices; Case/Package: SOT-23-6; Supplier 1: DigiKey; Supplier Part Number 1: LTC2315CTS8-12#TRMPBFCT-ND; Unit Price: 15.34; MFG_PN: LTC2315CTS8-12#TRMPBF
U5 = IC_OPAMP_LT1819CS8#TRPBF: IC OPAMP GBP 400MHz CIRCUIT 8SOIC; MFG: Analog Devices; Unit Price: 5.94; Package/Case: SOIC-8; Supplier 1: DigiKey; Supplier Part Number 1: LT1819CS8#TRPBFCT-ND; MFG_PN: LT1819CS8#TRPBF
U7 = IC_OPAMP_TLV9351IDCKR: IC OPAMP GP 3.5MHZ 350uV C70-5; MFG: Texas Instruments; Unit Price: .49; Package/Case: SOT-353; Supplier 1: DigiKey; Supplier Part Number 1: 296-TLV9351IDCKRCT-ND; MFG_PN: TLV9351IDCKR
U8 = IC_OPAMP_ADA4897-1ARZ: IC OPAMP GP 230MHZ 28uV 8SOIC; MFG: Analog Devices; Unit Price: 6.30; Package/Case: 8-SOIC; Supplier 1: DigiKey; Supplier Part Number 1: 505-ADA4897-1ARZ-ND; MFG_PN: ADA4897-1ARZ
U9 = IC_LM4041CYM3-ADJ-TR: IC VREF SHUNT ADJ 0.5% SOT23-3; MFG: Microchip; Case/Package: SOT-23; Supplier 1: DigiKey; Supplier Part Number 1: 576-1049-1-ND; Unit Price: .39; MFG_PN: LM4041CYM3-ADJ-TR

## Sheet SoftCore_SA_P2_PG5.SchDoc: =ProjectTitle
size B; Date: 05/11/2026; Engineer: Hab S Collector; Address1: 3621 Gin Way; Address2: Snellville GA, 30039; DocumentNumber: IMR-107-SCH; Revision: 1; SheetNumber: 5; SheetTotal: 7
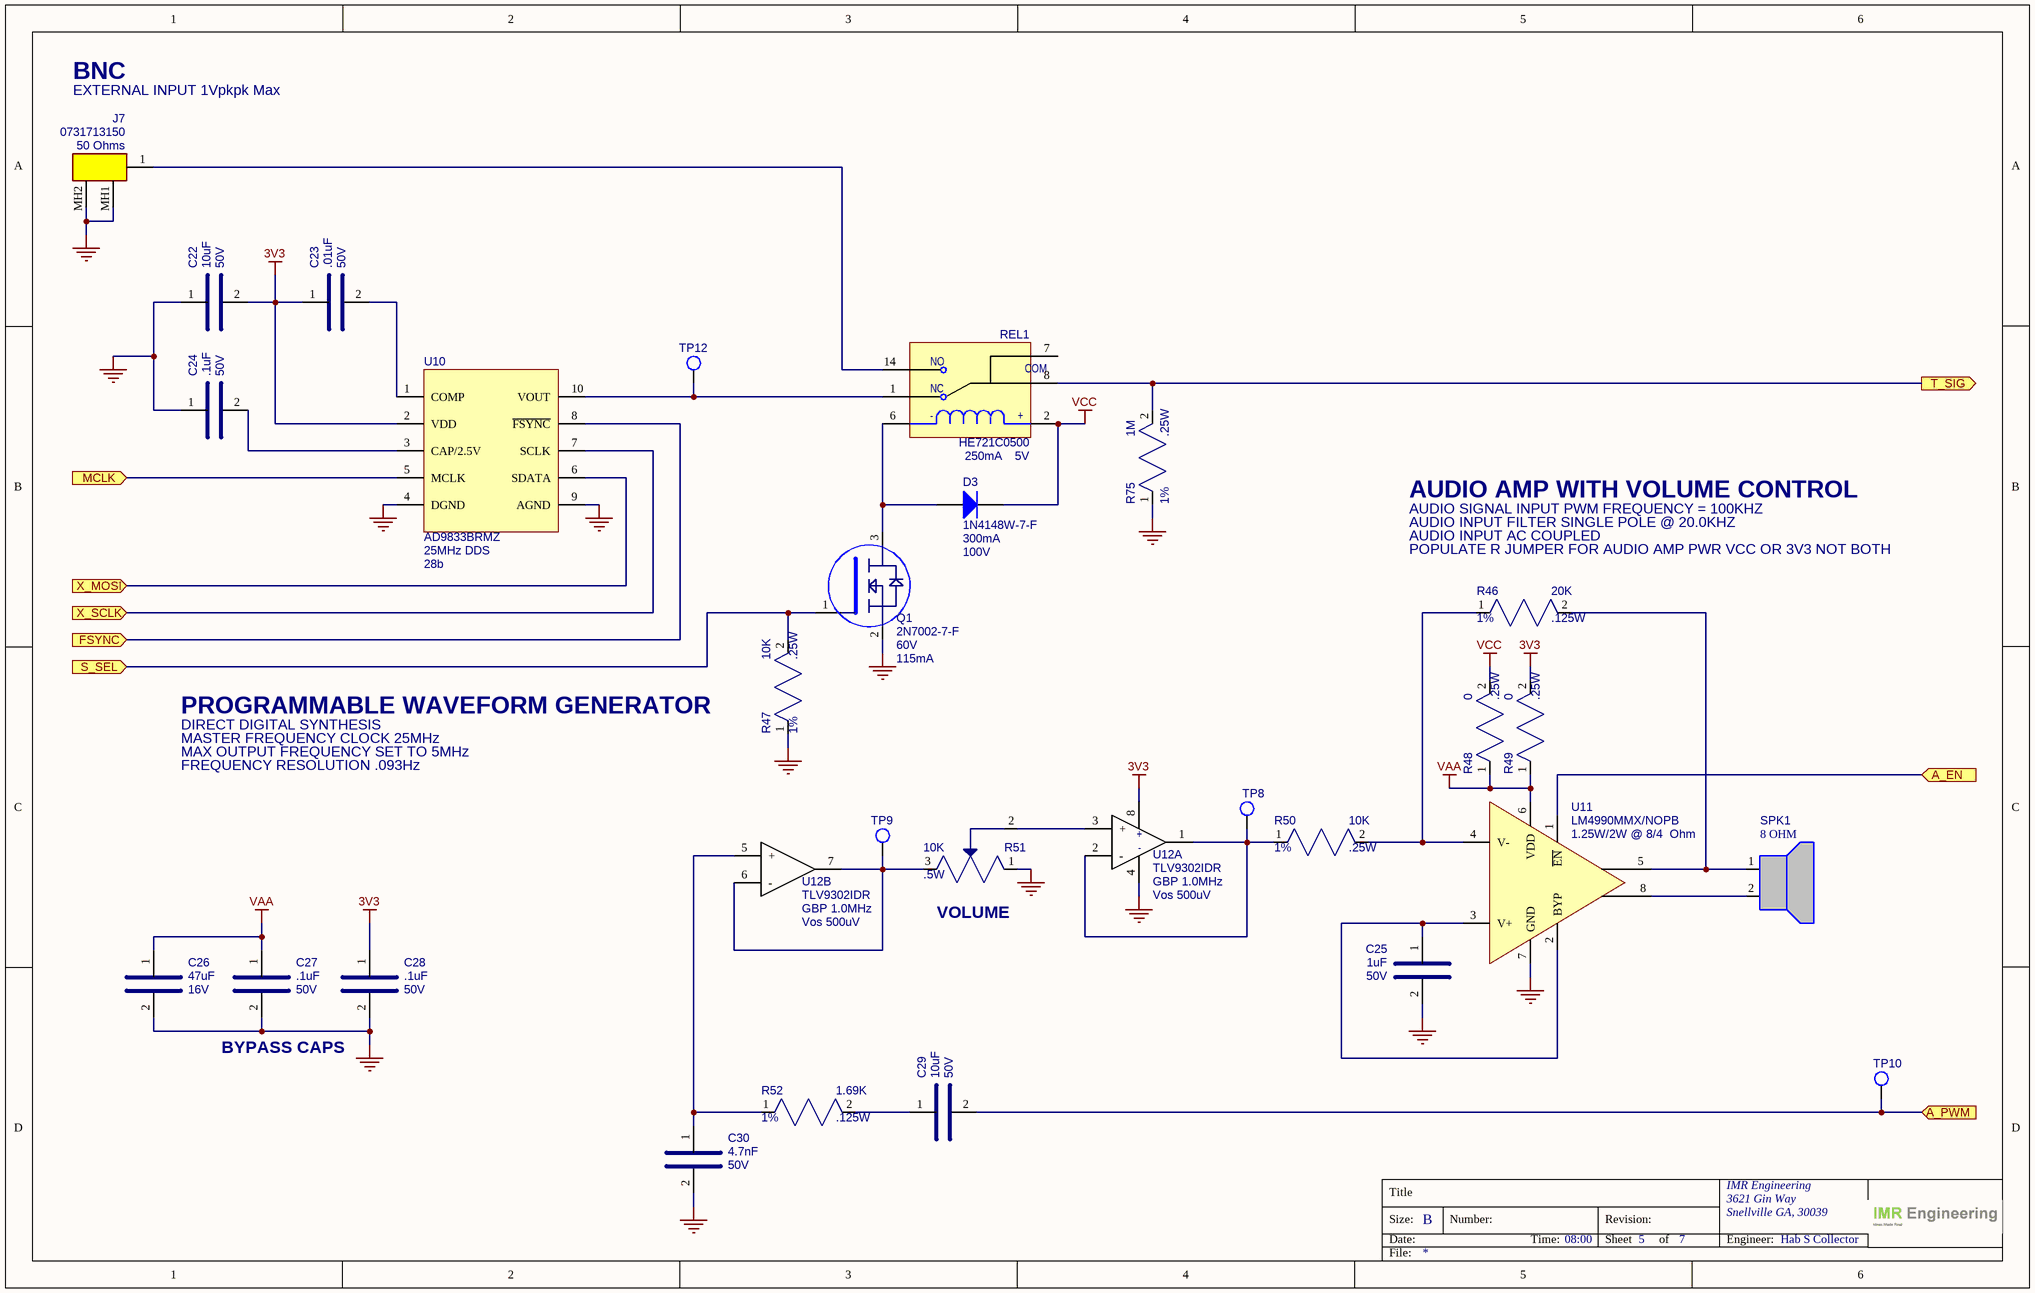
[diagram p4: SoftCore_SA_P2_PG5.SchDoc]

### Parts
C22  value 10uF  Voltage: 50V  [CAP_0805]  (hidden comment: GRM21BR61H106KE43L)
C23  value .01uF  Voltage: 50V  [CAP_0805]  (hidden comment: KGM21NR71H103KT)
C24  value .1uF  Voltage: 50V  [CAP_0805]  (hidden comment: KGM21NR71H104KT)
C25  value 1uF  Voltage: 50V  [CAP_0805]  (hidden comment: 08055C105K4T2A)
C26  value 47uF  Voltage: 16V  [CAP_1210]  (hidden comment: GRM32ER60J476ME20L)
C27  value .1uF  Voltage: 50V  [CAP_0805]  (hidden comment: KGM21NR71H104KT)
C28  value .1uF  Voltage: 50V  [CAP_0805]  (hidden comment: KGM21NR71H104KT)
C29  value 10uF  Voltage: 50V  [CAP_0805]  (hidden comment: GRM21BR61H106KE43L)
C30  value 4.7nF  Voltage: 50V  [CAP_0805]  (hidden comment: C0805C472K5RACAUTO)
D3  value 100V  Current: 300mA  [SOD123]  (hidden comment: 1N4148W-7-F)
J7  value 50 Ohms  [731713150]  (hidden comment: 0731713150)
Q1  value 60V  Current: 115mA  [SOT-23]  (hidden comment: 2N7002-7-F)
R46  value 20K  Power: .125W  Tolerance: 1%  [RES_0805]  (hidden comment: RC0805FR-0720KL)
R47  value 10K  Power: .25W  Tolerance: 1%  [RES_0805]  (hidden comment: RC0805FR-7W10KL)
R48  value 0  Power: .25W  [RES_0805]  (hidden comment: RC0805JR-070RL)
R49  value 0  Power: .25W  [RES_0805]  (hidden comment: RC0805JR-070RL)
R50  value 10K  Power: .25W  Tolerance: 1%  [RES_0805]  (hidden comment: RC0805FR-7W10KL)
R51  value 10K  Power: .5W  [BOURNS_3386F]  (hidden comment: 3386F-1-103TLF)
R52  value 1.69K  Power: .125W  Tolerance: 1%  [RES_0805]  (hidden comment: RC0805FR-071K69L)
R75  value 1M  Power: .25W  Tolerance: 1%  [RES_0805]  (hidden comment: RC0805FR-7W1ML)
REL1  value 5V  Current: 250mA  [HE700]  (hidden comment: HE721C0500)
SPK1  value 8 OHM  [HDR_1X2_100MILL]  (hidden comment: TBD)
TP8  (no value)  [TEST_POINT_35MIL_TH]  (no BOM)
TP9  (no value)  [TEST_POINT_35MIL_TH]  (no BOM)
TP10  (no value)  [TEST_POINT_35MIL_TH]  (no BOM)
TP12  (no value)  [TEST_POINT_35MIL_TH]  (no BOM)
U10  value 25MHz DDS  Tuning Word Width: 28b  [RM_10_ADI]  (hidden comment: AD9833BRMZ)
U11  value 1.25W/2W @ 8/4  Ohm  [SOP65P490X110-8N]  (hidden comment: LM4990MMX/NOPB)
U12  value GBP 1.0MHz  Vos: Vos 500uV  [SOIC-8_49]  (hidden comment: TLV9302IDR)  (parts A,B of 2)

### Ports
A_EN (in), A_PWM (in), FSYNC (in), MCLK (in), S_SEL (in), T_SIG (out), X_MOSI (in), X_SCLK (in)

### Nets
3V3: C22.2 C23.1 C28.1 R49.2 U10.2(VDD) U12.8
GND: C22.1 C24.1 C25.2 C26.2 C27.2 C28.2 C30.2 J7.MH1 J7.MH2 Q1.2(E) R47.1 R51.1 R75.1 U10.4(DGND) U10.9(AGND) U11.7(GND) U12.4
VAA: C26.1 C27.1 R48.1 R49.1 U11.6(VDD)
VCC: D3.2(K) R48.2 REL1.2
FSYNC: U10.8(~{FSYNC}) ; port FSYNC
NetC23_2: C23.2 U10.1(COMP)
NetC24_2: C24.2 U10.3(CAP/2.5V)
NetC25_1: C25.1 U11.2(BYP) U11.3(V+)
NetC29_1: C29.1 R52.2
NetC29_2: C29.2 TP10.1 ; port A_PWM
NetC30_1: C30.1 R52.1 U12.5(+)
NetD3_1: D3.1(A) Q1.3(C) REL1.6
NetJ1_1: U10.7(SCLK) ; port X_SCLK
NetJ1_2: U10.6(SDATA) ; port X_MOSI
NetJ1_7: U11.1(~{EN}) ; port A_EN
NetJ6_8: Q1.1(B) R47.2 ; port S_SEL
NetJ7_1: J7.1 REL1.14(NO)
NetR45_2: R75.2 REL1.8(COM) ; port T_SIG
NetR46_1: R46.1 R50.2 U11.4(V-)
NetR46_2: R46.2 SPK1.1 U11.5(VO1)
NetR50_1: R50.1 TP8.1 U12.1 U12.2(-)
NetR51_2: R51.2 U12.3(+)
NetR51_3: R51.3 TP9.1 U12.6(-) U12.7
NetR74_2: U10.5(MCLK) ; port MCLK
NetREL1_1: REL1.1(NC) TP12.1 U10.10(VOUT)
NetSPK1_2: SPK1.2 U11.8(VO2)

Not connected (* = marked no-connect by the designer): REL1 7(COM)

### Notes on the sheet
- BNC
- EXTERNAL INPUT 1Vpkpk Max
- AUDIO AMP WITH VOLUME CONTROL
- POPULATE R JUMPER FOR AUDIO AMP PWR VCC OR 3V3 NOT BOTH
- AUDIO SIGNAL INPUT PWM FREQUENCY = 100KHZ
- AUDIO INPUT FILTER SINGLE POLE @ 20.0KHZ
- AUDIO INPUT AC COUPLED
- PROGRAMMABLE WAVEFORM GENERATOR
- DIRECT DIGITAL SYNTHESIS
- MASTER FREQUENCY CLOCK 25MHz
- MAX OUTPUT FREQUENCY SET TO 5MHz
- FREQUENCY RESOLUTION .093Hz
- (near R51) VOLUME
- BYPASS CAPS
- Title
- Size:
- Date:
- B
- Number:
- Time:
- Revision:
- Sheet
- of
- IMR Engineering
- Engineer:
- File:
- (in symbol RELAY_HE721C0500) -; +

### Library data of the parts
C22 C29 = CAP_SMD_10UF_50V_0805: CAP CER 10UF 50V X5R 0805; MFG: Murata Electronics; Case/Package: 0805; MFG_PN: GRM21BR61H106KE43L; Supplier 1: DigiKey; Supplier Part Number 1: 490-18663-1-ND; Unit Price: .28
C23 = CAP_SMD_0.01UF_50V_0805: as C2 on sheet SoftCore_SA_P2_PG2; Case/Package: 0805; MFG_PN: KGM21NR71H103KT; Supplier 1: DigiKey; Supplier Part Number 1: 478-KGM21NR71H103KTCT-ND; Unit Price: .1
C24 C27 C28 = CAP_SMD_0.1UF_50V_0805: as C1 on sheet SoftCore_SA_P2_PG2; Case/Package: 0805; MFG_PN: KGM21NR71H104KT; Supplier 1: DigiKey; Supplier Part Number 1: 478-KGM21NR71H104KTCT-ND; Unit Price: .1
C25 = CAP_SMD_1UF_50V_0805: CAP CER 1UF 50V X7R 0805; MFG: KYOCERA AVX; Case/Package: 0805; MFG_PN: 08055C105K4T2A; Supplier 1: DigiKey; Supplier Part Number 1: 478-KAM21KR71H105KUCT-ND; Unit Price: .27
C26 = CAP_SMD_47UF_16V_1210: as C4 on sheet SoftCore_SA_P2_PG2; Case/Package: 1210; MFG_PN: GRM32ER60J476ME20L; Supplier 1: DigiKey; Supplier Part Number 1: 490-1887-1-ND; Unit Price: .28
C30 = CAP_SMD_4.7NF_50V_0805: CAP CER 4.7NF 50V X7R 0805; MFG: KEMET; Case/Package: 0805; MFG_PN: C0805C472K5RACAUTO; Supplier 1: DigiKey; Supplier Part Number 1: 399-6969-1-ND; Unit Price: .12
D3 = DIODE_1N4148W-7-F: as D1 on sheet SoftCore_SA_P2_PG4; Case/Package: SOD-123; Supplier 1: DigiKey; Supplier Part Number 1: 1N4148W-FDICT-ND; Unit Price: .16; MFG_PN: 1N4148W-7-F
J7 = CONN_MOLEX_0731713150: CONN BNC RCPT R/A 50 OHM PCB; MFG: Molex; Case/Package: 73099-2; Supplier 1: DigiKey; Supplier Part Number 1: WM20430-ND; Unit Price: 1.40; MFG_PN: 0731713150
Q1 = MOSFET_NCH_2N7002-7-F: MOSFET N-CH 60V 115MA SOT23-3; MFG: Diodes Inc; Case/Package: SOT-23; Supplier 1: DigiKey; Supplier Part Number 1: 2N7002-FDICT-ND; Unit Price: .20; MFG_PN: 2N7002-7-F
R46 = RES_SMD_20K_0805_1/8W_1%: RES SMD 20K OHM 1% 1/8W 0805; MFG: Yageo; Case/Package: 0805; MFG_PN: RC0805FR-0720KL; Supplier 1: DigiKey; Supplier Part Number 1: 311-20.0KCRCT-ND; Unit Price: .1
R47 R50 = RES_SMD_10K_0805_1/4W_1%: RES SMD 10K OHM 1% 1/4W 0805; MFG: Yageo; Case/Package: 0805; MFG_PN: RC0805FR-7W10KL; Supplier 1: DigiKey; Supplier Part Number 1: 13-RC0805FR-7W10KLCT-ND; Unit Price: .10
R48 R49 = RES_SMD_0_0805_1/8W_1%: RES SMD 0 OHM 1% 1/8W 0805; MFG: Yageo; Case/Package: 0805; MFG_PN: RC0805JR-070RL; Supplier 1: DigiKey; Supplier Part Number 1: 311-0.0ARCT-ND; Unit Price: .1; Tolerance: 1%
R51 = RES_POT_10K_1XGANG_LINEAR: POT 10K OHM 1/20W LINEAR - 1X GANG; MFG: Bourns Inc.; Case/Package: 3386F; MFG_PN: 3386F-1-103TLF; Supplier 1: DigiKey; Supplier Part Number 1: 3386F-103TLF-ND; Unit Price: 2.26
R52 = RES_SMD_1.69K_0805_1/8W_1%: RES SMD 1.69K OHM 1% 1/8W 0805; MFG: Yageo; Case/Package: 0805; MFG_PN: RC0805FR-071K69L; Supplier 1: DigiKey; Supplier Part Number 1: 311-1.69KCRCT-ND; Unit Price: .1
R75 = RES_SMD_1M_0805_1/4W_1%: RES SMD 1M OHM 1% 1/4W 0805; MFG: Yageo; Case/Package: 0805; MFG_PN: RC0805FR-7W1ML; Supplier 1: DigiKey; Supplier Part Number 1: 13-RC0805FR-7W1MLCT-ND; Unit Price: .10
REL1 = RELAY_HE721C0500: RELAY REED SPDT 250MA 5V; MFG: Littlefuse; Case/Package: HE700; Supplier 1: DigiKey; Supplier Part Number 1: HE112-ND; Unit Price: 3.77; MFG_PN: HE721C0500
SPK1 = CONN_SPKR_HEADER_2P_100MIL: CONN SPEAKER HEADER GENERIC VERT 2POS 2.54MM; Case/Package: 2P_2.54MM; MFG: GENERIC; Supplier 1: Digi-Key; Supplier Part Number 1: TBD; Unit Price: 1.00; MFG_PN: TBD
TP8-TP10 TP12 = CONN_TEST_POINT_TH_PROBE_TIP: TEST POINT TH FITS DSO PROBE TIP
U10 = IC_AD9833BRMZ: IC DDS 25MHZ 10BIT 10MSOP; MFG: Analog Devices; Case/Package: 10-MSOP; Supplier 1: DigiKey; Supplier Part Number 1: 505-AD9833BRMZ-ND; Unit Price: 15.19; MFG_PN: AD9833BRMZ
U11 = IC_LM4990MMX/NOPB: IC AMP CLASS AB MONO 2W 8VSSOP; MFG: Texas Instruments; Case/Package: SC-70-6; Supplier 1: DigiKey; Supplier Part Number 1: 296-37579-1-ND; Unit Price: .45; MFG_PN: LM4990MMX/NOPB
U12 = IC_OPAMP_TLV9302IDR: IC OPAMP GP 2 CIRCUIT 8SOIC; MFG: Texas Instruments; Unit Price: .66; Package/Case: SOIC-8; Supplier 1: DigiKey; Supplier Part Number 1: 296-53513-1-ND; MFG_PN: TLV9302IDR

## Sheet SoftCore_SA_P2_PG6.SchDoc: =ProjectTitle
size B; Date: 05/11/2026; Engineer: Hab S Collector; Address1: 3621 Gin Way; Address2: Snellville GA, 30039; DocumentNumber: IMR-107-SCH; Revision: 1; SheetNumber: 6; SheetTotal: 7
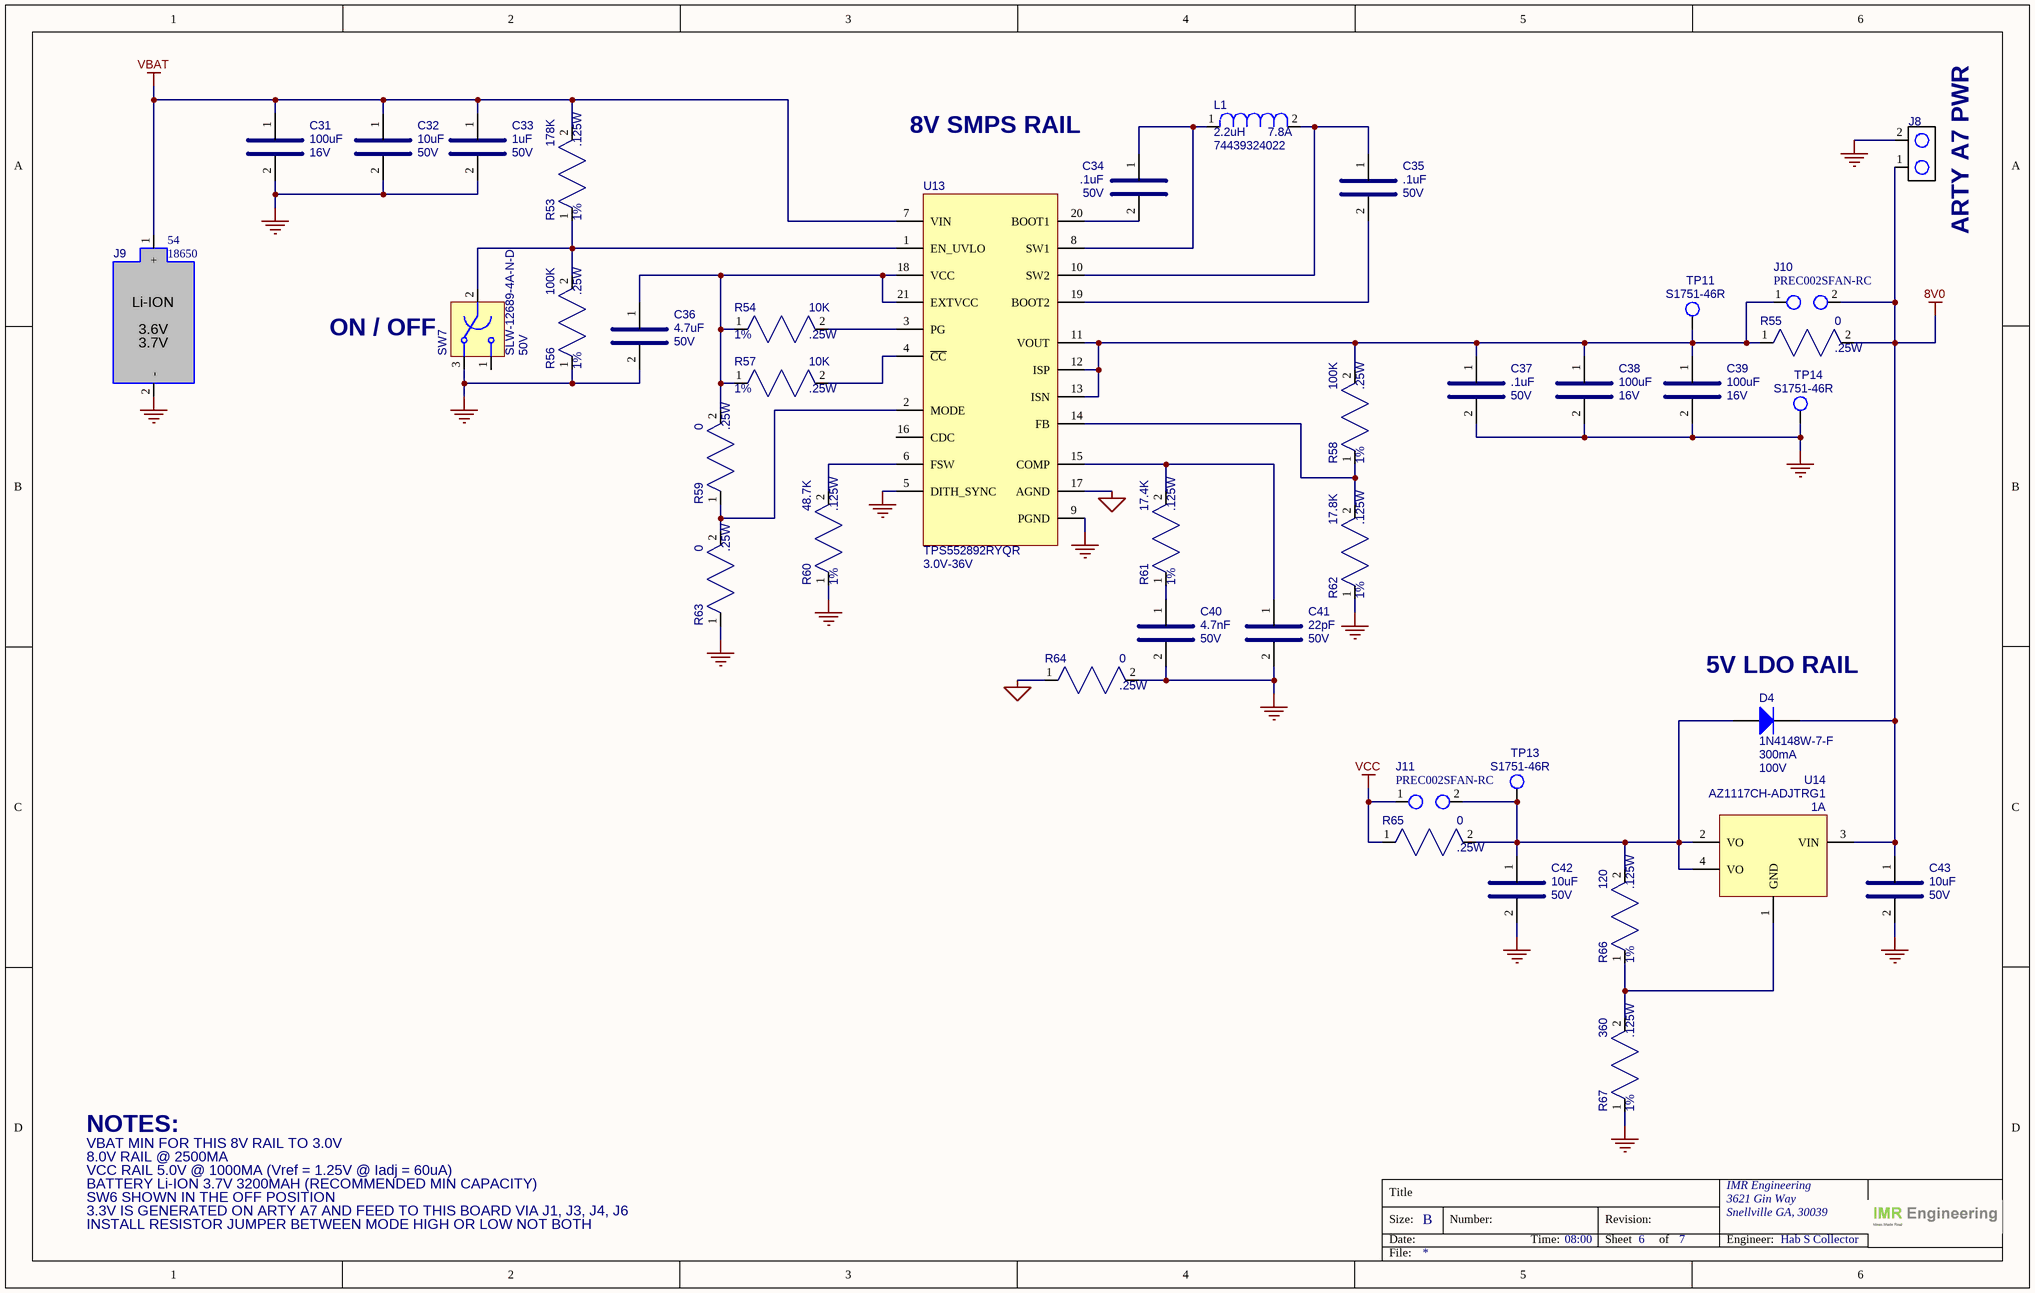
[diagram p5: SoftCore_SA_P2_PG6.SchDoc]

### Parts
C31  value 100uF  Voltage: 16V  [CAP_1210]  (hidden comment: EMK325ABJ107MM-P)
C32  value 10uF  Voltage: 50V  [CAP_0805]  (hidden comment: GRM21BR61H106KE43L)
C33  value 1uF  Voltage: 50V  [CAP_0805]  (hidden comment: 08055C105K4T2A)
C34  value .1uF  Voltage: 50V  [CAP_0805]  (hidden comment: KGM21NR71H104KT)
C35  value .1uF  Voltage: 50V  [CAP_0805]  (hidden comment: KGM21NR71H104KT)
C36  value 4.7uF  Voltage: 50V  [CAP_0805]  (hidden comment: GRM21BR61H475KE51L)
C37  value .1uF  Voltage: 50V  [CAP_0805]  (hidden comment: KGM21NR71H104KT)
C38  value 100uF  Voltage: 16V  [CAP_1210]  (hidden comment: EMK325ABJ107MM-P)
C39  value 100uF  Voltage: 16V  [CAP_1210]  (hidden comment: EMK325ABJ107MM-P)
C40  value 4.7nF  Voltage: 50V  [CAP_0805]  (hidden comment: C0805C472K5RACAUTO)
C41  value 22pF  Voltage: 50V  [CAP_0805]  (hidden comment: C0805C220K5RACAUTO)
C42  value 10uF  Voltage: 50V  [CAP_0805]  (hidden comment: GRM21BR61H106KE43L)
C43  value 10uF  Voltage: 50V  [CAP_0805]  (hidden comment: GRM21BR61H106KE43L)
D4  value 100V  Current: 300mA  [SOD123]  (hidden comment: 1N4148W-7-F)
J8  PREC002SFAN-RC  [HDR_1X2_100MILL]  (value not drawn)
J9  value 18650  [CONN_BATTERY_18650]  (hidden comment: 54)
J10  PREC002SFAN-RC  [HDR_1X2_100MILL]
J11  PREC002SFAN-RC  [HDR_1X2_100MILL]
L1  value 2.2uH  Current: 7.8A  [WE-XHMI_4030]  (hidden comment: 74439324022)
R53  value 178K  Power: .125W  Tolerance: 1%  [RES_0805]  (hidden comment: RC0805FR-07178KL)
R54  value 10K  Power: .25W  Tolerance: 1%  [RES_0805]  (hidden comment: RC0805FR-7W10KL)
R55  value 0  Power: .25W  [RES_0805]  (hidden comment: RC0805JR-070RL)
R56  value 100K  Power: .25W  Tolerance: 1%  [RES_0805]  (hidden comment: RC0805FR-07100KL)
R57  value 10K  Power: .25W  Tolerance: 1%  [RES_0805]  (hidden comment: RC0805FR-7W10KL)
R58  value 100K  Power: .25W  Tolerance: 1%  [RES_0805]  (hidden comment: RC0805FR-07100KL)
R59  value 0  Power: .25W  [RES_0805]  (hidden comment: RC0805JR-070RL)
R60  value 48.7K  Power: .125W  Tolerance: 1%  [RES_0805]  (hidden comment: RC0805FR-0748K7L)
R61  value 17.4K  Power: .125W  Tolerance: 1%  [RES_0805]  (hidden comment: RC0805FR-0717K4L)
R62  value 17.8K  Power: .125W  Tolerance: 1%  [RES_0805]  (hidden comment: RC0805FR-0717K8L)
R63  value 0  Power: .25W  [RES_0805]  (hidden comment: RC0805JR-070RL)
R64  value 0  Power: .25W  [RES_0805]  (hidden comment: RC0805JR-070RL)
R65  value 0  Power: .25W  [RES_0805]  (hidden comment: RC0805JR-070RL)
R66  value 120  Power: .125W  Tolerance: 1%  [RES_0805]  (hidden comment: RC0805FR-132K49L)
R67  value 360  Power: .125W  Tolerance: 1%  [RES_0805]  (hidden comment: RC0805FR-076K81L)
SW7  value 50V  [SLW126894AND]  (hidden comment: SLW-12689-4A-N-D)
TP11  S1751-46R  [HARWIN_S1751]
TP13  S1751-46R  [HARWIN_S1751]
TP14  S1751-46R  [HARWIN_S1751]
U13  value 3.0V-36V  [CONV_TPS552892RYQR]  (hidden comment: TPS552892RYQR)
U14  Current: 1A  [SOT223]  (hidden comment: AZ1117CH-ADJTRG1)

### Nets
8V0: C43.1 D4.2(K) J8.1 J10.2 R55.2 U14.3(VIN)
AGND: R64.1 U13.17(AGND)
GND: C31.2 C32.2 C33.2 C36.2 C37.2 C38.2 C39.2 C40.2 C41.2 C42.2 C43.2 J8.2 J9.2(-) R56.1 R60.1 R62.1 R63.1 R64.2 R67.1 SW7.3 TP14.1 U13.5(DITH_SYNC) U13.9(PGND)
VBAT: C31.1 C32.1 C33.1 J9.1(+) R53.2 U13.7(VIN)
VCC: J11.1 R65.1
NetC34_1: C34.1 L1.1 U13.8(SW1)
NetC34_2: C34.2 U13.20(BOOT1)
NetC35_1: C35.1 L1.2 U13.10(SW2)
NetC35_2: C35.2 U13.19(BOOT2)
NetC36_1: C36.1 R54.1 R57.1 R59.2 U13.18(VCC) U13.21(EXTVCC)
NetC37_1: C37.1 C38.1 C39.1 J10.1 R55.1 R58.2 TP11.1 U13.11(VOUT) U13.12(ISP) U13.13(ISN)
NetC40_1: C40.1 R61.1
NetC41_1: C41.1 R61.2 U13.15(COMP)
NetC42_1: C42.1 D4.1(A) J11.2 R65.2 R66.2 TP13.1 U14.2(VO) U14.4(VO)
NetR53_1: R53.1 R56.2 SW7.2 U13.1(EN_UVLO)
NetR54_2: R54.2 U13.3(PG)
NetR57_2: R57.2 U13.4(~{CC})
NetR58_1: R58.1 R62.2 U13.14(FB)
NetR59_1: R59.1 R63.2 U13.2(MODE)
NetR60_2: R60.2 U13.6(FSW)
NetR66_1: R66.1 R67.2 U14.1(GND)

Not connected (* = marked no-connect by the designer): SW7 1; U13 16(CDC)

### Notes on the sheet
- 8V SMPS RAIL
- (near J8) ARTY A7 PWR
- (near SW7) ON / OFF
- (near D4) 5V LDO RAIL
- VBAT MIN FOR THIS 8V RAIL TO 3.0V
- NOTES:
- 8.0V RAIL @ 2500MA
- VCC RAIL 5.0V @ 1000MA (Vref = 1.25V @ Iadj = 60uA)
- BATTERY Li-ION 3.7V 3200MAH (RECOMMENDED MIN CAPACITY)
- SW6 SHOWN IN THE OFF POSITION
- 3.3V IS GENERATED ON ARTY A7 AND FEED TO THIS BOARD VIA J1, J3, J4, J6
- INSTALL RESISTOR JUMPER BETWEEN MODE HIGH OR LOW NOT BOTH
- Title
- Size:
- Date:
- B
- Number:
- Time:
- Revision:
- Sheet
- of
- IMR Engineering
- Engineer:
- File:
- (in symbol CONN_BATT_18650) Li-ION; 3.6V; 3.7V

### Library data of the parts
C31 C38 C39 = CAP_SMD_100UF_16V_SMD: CAP CER 100UF 16V X7S SMD; MFG: Taiyo Yuden; Case/Package: CAPC6153X670N; MFG_PN: EMK325ABJ107MM-P; Supplier 1: DigiKey; Supplier Part Number 1: 587-5426-1-ND; Unit Price: 1.92
C32 C42 C43 = CAP_SMD_10UF_50V_0805: as C22 on sheet SoftCore_SA_P2_PG5; Case/Package: 0805; MFG_PN: GRM21BR61H106KE43L; Supplier 1: DigiKey; Supplier Part Number 1: 490-18663-1-ND; Unit Price: .28
C33 = CAP_SMD_1UF_50V_0805: as C25 on sheet SoftCore_SA_P2_PG5; Case/Package: 0805; MFG_PN: 08055C105K4T2A; Supplier 1: DigiKey; Supplier Part Number 1: 478-KAM21KR71H105KUCT-ND; Unit Price: .27
C34 C35 C37 = CAP_SMD_0.1UF_50V_0805: as C1 on sheet SoftCore_SA_P2_PG2; Case/Package: 0805; MFG_PN: KGM21NR71H104KT; Supplier 1: DigiKey; Supplier Part Number 1: 478-KGM21NR71H104KTCT-ND; Unit Price: .1
C36 = CAP_SMD_4.7UF_50V_0805: CAP CER 4.7UF 50V X5R 0805; MFG: Murata Electronics; Case/Package: 0805; MFG_PN: GRM21BR61H475KE51L; Supplier 1: DigiKey; Supplier Part Number 1: 490-10751-1-ND; Unit Price: .19
C40 = CAP_SMD_4.7NF_50V_0805: CAP CER 4.7NF 50V X7R 0805; MFG: KEMET; Case/Package: 0805; MFG_PN: C0805C472K5RACAUTO; Supplier 1: DigiKey; Supplier Part Number 1: 399-6969-1-ND; Unit Price: .12
C41 = CAP_SMD_22PF_50V_0805: CAP CER 22PF 50V X7R 0805; MFG: KEMET; Case/Package: 0805; MFG_PN: C0805C220K5RACAUTO; Supplier 1: DigiKey; Supplier Part Number 1: 399-17627-1-ND; Unit Price: .24
D4 = DIODE_1N4148W-7-F: as D1 on sheet SoftCore_SA_P2_PG4; Case/Package: SOD-123; Supplier 1: DigiKey; Supplier Part Number 1: 1N4148W-FDICT-ND; Unit Price: .16; MFG_PN: 1N4148W-7-F
J8 = CONN_HEADER_2P_100MIL_VERT: CONN HEADER VERT 2POS 2.54MM; MFG: Sullins Connector Solutions; Case/Package: 2P_2.54MM; Supplier 1: Digi-Key; Supplier Part Number 1: S1212EC-02-ND; Value: *; Unit Price: .07; MFG_PN: PREC002SFAN-RC
J9 = CONN_BATT_18650: CONN HEADER VERT 2POS 2.54MM; MFG: Keystone Electronics; Note: This is actually 2 connectors on PCB - priced as such but BOM will reflect only one; Case/Package: 18650 SINGLE CELL; Supplier 1: Digi-Key; Supplier Part Number 1: 36-54-ND; Unit Price: 1.10; MFG_PN: 54
J10 J11 = CONN_JUMPER_2P_100MIL_VERT: CONN HEADER VERT 2POS 2.54MM; MFG: Sullins Connector Solutions; Case/Package: 2P_2.54MM; MFG_PN: PREC002SFAN-RC; Supplier 1: Digi-Key; Supplier Part Number 1: S1212EC-02-ND; Value: *; Unit Price: .07
L1 = INDUCTOR_74439324022: POWER INDUCTOR 4030; 2.2UH; 7.80; MFG: Würth Elektronik; Tolerance: 20%; Case/Package: WE-XHMI; Supplier 1: DigiKey; Supplier Part Number 1: 732-74439324022CT-ND; Unit Price: 1.80; MFG_PN: 74439324022
R53 = RES_SMD_178K_0805_1/8W_1%: RES SMD 178K OHM 1% 1/8W 0805; MFG: Yageo; Case/Package: 0805; MFG_PN: RC0805FR-07178KL; Supplier 1: DigiKey; Supplier Part Number 1: 311-178KCRCT-ND; Unit Price: .10
R54 R57 = RES_SMD_10K_0805_1/4W_1%: RES SMD 10K OHM 1% 1/4W 0805; MFG: Yageo; Case/Package: 0805; MFG_PN: RC0805FR-7W10KL; Supplier 1: DigiKey; Supplier Part Number 1: 13-RC0805FR-7W10KLCT-ND; Unit Price: .10
R55 R59 R63-R65 = RES_SMD_0_0805_1/8W_1%: RES SMD 0 OHM 1% 1/8W 0805; MFG: Yageo; Case/Package: 0805; MFG_PN: RC0805JR-070RL; Supplier 1: DigiKey; Supplier Part Number 1: 311-0.0ARCT-ND; Unit Price: .1; Tolerance: 1%
R56 R58 = RES_SMD_100K_0805_1/4W_1%: RES SMD 100K OHM 1% 1/4W 0805; MFG: Yageo; Case/Package: 0805; MFG_PN: RC0805FR-07100KL; Supplier 1: DigiKey; Supplier Part Number 1: 311-100KCRCT-ND; Unit Price: .13
R60 = RES_SMD_48.7K_0805_1/8W_1%: RES SMD 48.7K OHM 1% 1/8W 0805; MFG: Yageo; Case/Package: 0805; MFG_PN: RC0805FR-0748K7L; Supplier 1: DigiKey; Supplier Part Number 1: 311-48.7KCRCT-ND; Unit Price: .1
R61 = RES_SMD_17.4K_0805_1/8W_1%: RES SMD 17.4K OHM 1% 1/8W 0805; MFG: Yageo; Case/Package: 0805; MFG_PN: RC0805FR-0717K4L; Supplier 1: DigiKey; Supplier Part Number 1: 311-17.4KCRCT-ND; Unit Price: .10
R62 = RES_SMD_17.8K_0805_1/8W_1%: RES SMD 17.8K OHM 1% 1/8W 0805; MFG: Yageo; Case/Package: 0805; MFG_PN: RC0805FR-0717K8L; Supplier 1: DigiKey; Supplier Part Number 1: 311-17.8KCRCT-ND; Unit Price: .10
R66 = RES_SMD_2.49K_0805_1/8W_1%: RES SMD 2.49K OHM 1% 1/8W 0805; MFG: Yageo; Case/Package: 0805; MFG_PN: RC0805FR-132K49L; Supplier 1: DigiKey; Supplier Part Number 1: 13-RC0805FR-132K49LCT-ND; Unit Price: .1
R67 = RES_SMD_6.81K_0805_1/8W_1%: RES SMD 6.81K OHM 1% 1/8W 0805; MFG: Yageo; Case/Package: 0805; MFG_PN: RC0805FR-076K81L; Supplier 1: DigiKey; Supplier Part Number 1: 311-6.81KCRCT-ND; Unit Price: .10
SW7 = SWITCH_SLW-12689-4A-N-D: SWITCH SLIDE SPDT 300MA 50V; MFG: Same Sky; Case/Package: SLW-12689-4A-N-D; Supplier 1: DigiKey; Supplier Part Number 1: 2223-SLW-12689-4A-N-D-ND; Unit Price: .48; Current: 300mA; MFG_PN: SLW-12689-4A-N-D
TP11 TP13 TP14 = CONN_TEST_POINT_S1751-46R: PCB TEST POINT CONNECT; MFG: Harwin Inc; Case/Package: S1751; Supplier 1: Digi-Key; Supplier Part Number 1: 952-1478-1-ND; Value: *; Unit Price: .28; MFG_PN: S1751-46R
U13 = IC_SMPS_TPS552892RYQR: IC REG BUCK ADJ 1A 16HTSSOP; MFG: Texas Instruments; Current: 8A; Case/Package: VQFN; Supplier 1: DigiKey; Supplier Part Number 1: 296-TPS552892RYQRCT-ND; Unit Price: 6.42; MFG_PN: TPS552892RYQR
U14 = IC_REG_AZ1117CH-ADJTRG1: IC REG BUCK ADJ 2A SOT23; MFG: Diodes Incorporated; Case/Package: SOT-223-3; Supplier 1: DigiKey; Supplier Part Number 1: AZ1117CH-ADJTRG1DICT-ND; Unit Price: .2; VALUE: ADJ; MFG_PN: AZ1117CH-ADJTRG1

## Sheet SoftCore_SA_P2_PG7.SchDoc: =ProjectTitle
size B; Date: 05/11/2026; Engineer: Hab S Collector; Address1: 3621 Gin Way; Address2: Snellville GA, 30039; DocumentNumber: IMR-107-SCH; Revision: 1; SheetNumber: 7; SheetTotal: 7
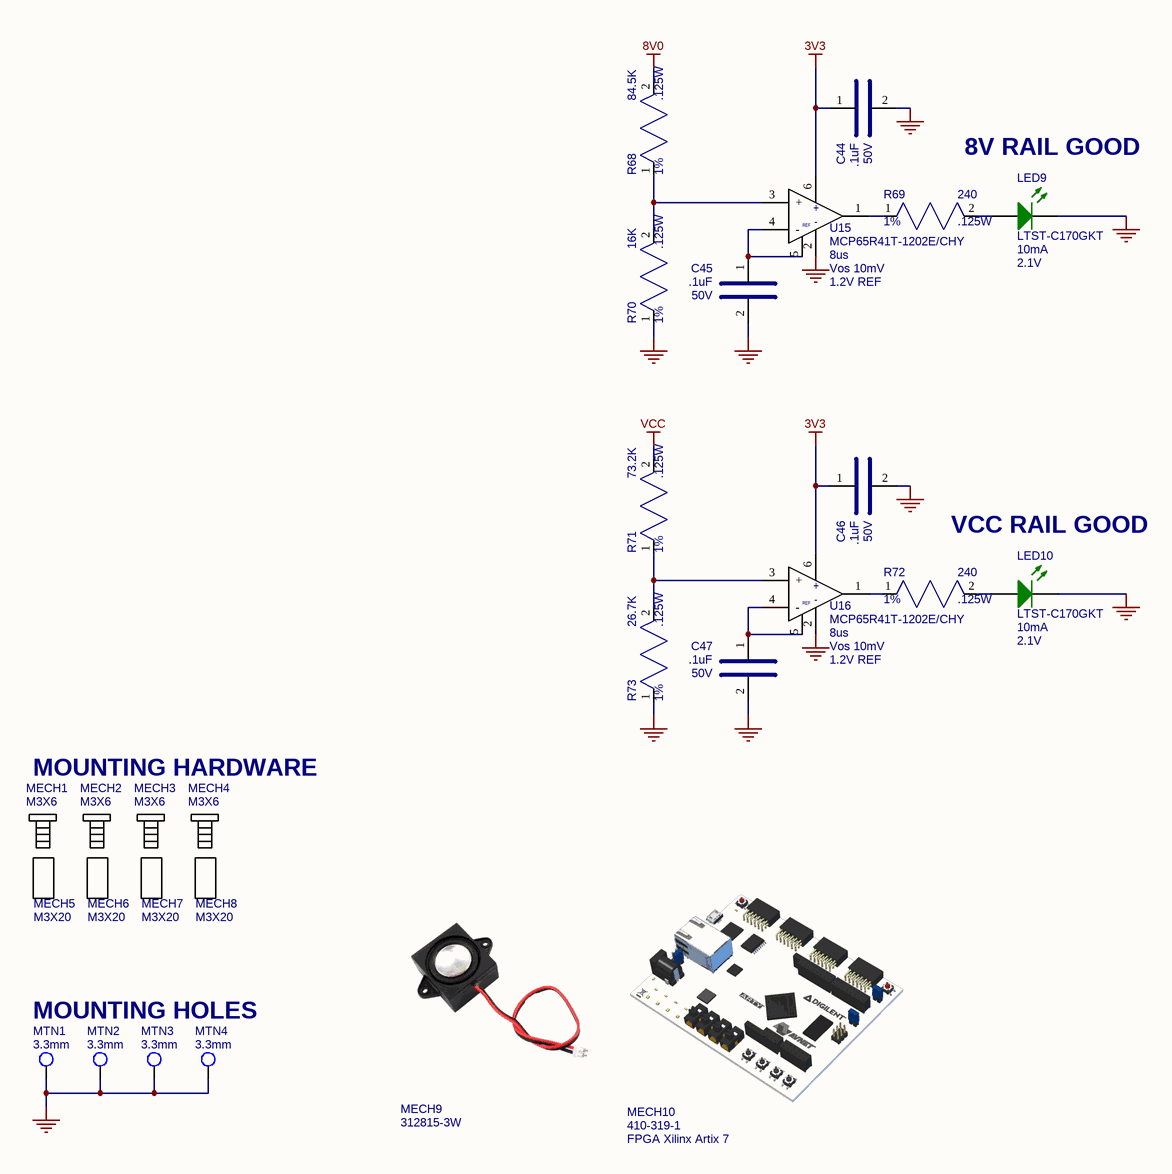
[diagram p6: SoftCore_SA_P2_PG7.SchDoc]

### Parts
C44  value .1uF  Voltage: 50V  [CAP_0805]  (hidden comment: KGM21NR71H104KT)
C45  value .1uF  Voltage: 50V  [CAP_0805]  (hidden comment: KGM21NR71H104KT)
C46  value .1uF  Voltage: 50V  [CAP_0805]  (hidden comment: KGM21NR71H104KT)
C47  value .1uF  Voltage: 50V  [CAP_0805]  (hidden comment: KGM21NR71H104KT)
LED9  value 2.1V  Current: 10mA  [LED_0805]  (hidden comment: LTST-C170GKT)
LED10  value 2.1V  Current: 10mA  [LED_0805]  (hidden comment: LTST-C170GKT)
MECH1  Size: M3X6  [MECHANICAL_SCREW_M3X6]  (hidden comment: RM3X6MM 2701)
MECH2  Size: M3X6  [MECHANICAL_SCREW_M3X6]  (hidden comment: RM3X6MM 2701)
MECH3  Size: M3X6  [MECHANICAL_SCREW_M3X6]  (hidden comment: RM3X6MM 2701)
MECH4  Size: M3X6  [MECHANICAL_SCREW_M3X6]  (hidden comment: RM3X6MM 2701)
MECH5  Size: M3X20  [MECHANICAL_SPACER_F_F_M3X20]  (hidden comment: 24407)
MECH6  Size: M3X20  [MECHANICAL_SPACER_F_F_M3X20]  (hidden comment: 24407)
MECH7  Size: M3X20  [MECHANICAL_SPACER_F_F_M3X20]  (hidden comment: 24407)
MECH8  Size: M3X20  [MECHANICAL_SPACER_F_F_M3X20]  (hidden comment: 24407)
MECH9  312815-3W  [312815-3W_PCB]
MECH10  value FPGA Xilinx Artix 7  [ARTY_A7_DEV_BOARD]  (hidden comment: 410-319-1)
MTN1  Hole Size: 3.3mm  [PMG_MT_HOLE_3.3MM]  (no BOM)
MTN2  Hole Size: 3.3mm  [PMG_MT_HOLE_3.3MM]  (no BOM)
MTN3  Hole Size: 3.3mm  [PMG_MT_HOLE_3.3MM]  (no BOM)
MTN4  Hole Size: 3.3mm  [PMG_MT_HOLE_3.3MM]  (no BOM)
R68  value 84.5K  Power: .125W  Tolerance: 1%  [RES_0805]  (hidden comment: RC0805FR-0784K5L)
R69  value 240  Power: .125W  Tolerance: 1%  [RES_0805]  (hidden comment: RC0805FR-13240RL)
R70  value 16K  Power: .125W  Tolerance: 1%  [RES_0805]  (hidden comment: RC0805FR-0716KL)
R71  value 73.2K  Power: .125W  Tolerance: 1%  [RES_0805]  (hidden comment: RC0805FR-0773K2L)
R72  value 240  Power: .125W  Tolerance: 1%  [RES_0805]  (hidden comment: RC0805FR-13240RL)
R73  value 26.7K  Power: .125W  Tolerance: 1%  [RES_0805]  (hidden comment: RC0805FR-0726K7L)
U15  Voltage Reference: 1.2V REF  Propagation Delay: 8us  Vos: Vos 10mV  [SOT-23-6_MC_MCH]  (hidden comment: MCP65R41T-1202E/CHY)
U16  Voltage Reference: 1.2V REF  Propagation Delay: 8us  Vos: Vos 10mV  [SOT-23-6_MC_MCH]  (hidden comment: MCP65R41T-1202E/CHY)

### Nets
3V3: C44.1 C46.1 U15.6 U16.6
8V0: R68.2
GND: C44.2 C45.2 C46.2 C47.2 LED9.K LED10.K MTN1.1 MTN2.1 MTN3.1 MTN4.1 R70.1 R73.1 U15.2 U16.2
VCC: R71.2
NetC45_1: C45.1 U15.4(-) U15.5
NetC47_1: C47.1 U16.4(-) U16.5
NetLED9_A: LED9.A R69.2
NetLED10_A: LED10.A R72.2
NetR68_1: R68.1 R70.2 U15.3(+)
NetR69_1: R69.1 U15.1
NetR71_1: R71.1 R73.2 U16.3(+)
NetR72_1: R72.1 U16.1

### Notes on the sheet
- 8V RAIL GOOD
- VCC RAIL GOOD
- MOUNTING HARDWARE
- MOUNTING HOLES
- Title
- Size:
- Date:
- B
- Number:
- Time:
- Revision:
- Sheet
- of
- IMR Engineering
- Engineer:
- File:
- (in symbol IC_COMPARATOR_MCP65R41T-1202E/CHY) REF

### Library data of the parts
C44-C47 = CAP_SMD_0.1UF_50V_0805: as C1 on sheet SoftCore_SA_P2_PG2; Case/Package: 0805; MFG_PN: KGM21NR71H104KT; Supplier 1: DigiKey; Supplier Part Number 1: 478-KGM21NR71H104KTCT-ND; Unit Price: .1
LED9 LED10 = LED_GREEN_LTST-C170GKT: LED GREEN CLEAR SMD; MFG: Lite-On; Case/Package: 0805; Supplier 1: DigiKey; Supplier Part Number 1: 160-1179-1-ND; Unit Price: .10; MFG_PN: LTST-C170GKT
MECH1-MECH4 = MECHANICAL_SCREW_M3X6_PAN_HEAD: SCREW M3X6 PAN HEAD SS; MFG: APM Hexseal; Case/Package: SCREW_M3X6; Supplier 1: DigiKey; Supplier Part Number 1: 335-1156-ND; Unit Price: .58; MFG_PN: RM3X6MM 2701
MECH5-MECH8 = MECHANICAL_STANDOFF_M3X20: HEX STANDOFF M3 BRASS 20MM; MFG: Keystone Electronics; Case/Package: STANDOFF_M3X20; Supplier 1: DigiKey; Supplier Part Number 1: 36-24407-ND; Unit Price: 1.36; MFG_PN: 24407
MECH9 = MECHANICAL_SPEAKER_MOUNTED: SPEAKER PANEL MOUNT; MFG: ARDUINO; Case/Package: 312815-3W_PCB; Supplier 1: ARDUINO; Supplier Part Number 1: 312815-3W; Unit Price: 2.50; MFG_PN: 312815-3W
MECH10 = MODULE_ARTY_A7: DEVELOPMENT BOARD FPGA XILINX A7; MFG: Digilent, Inc.; Case/Package: NA; Supplier 1: DigiKey; Supplier Part Number 1: 1286-1206-ND; Unit Price: 299.00; MFG_PN: 410-319-1
MTN1-MTN4 = MTN_HOLE_3.3MM: MOUNTING HOLE 3.3MM
R68 = RES_SMD_84.5K_0805_1/8W_1%: RES SMD 84.5K OHM 1% 1/8W 0805; MFG: Yageo; Case/Package: 0805; MFG_PN: RC0805FR-0784K5L; Supplier 1: DigiKey; Supplier Part Number 1: 311-84.5KCRCT-ND; Unit Price: .1
R69 R72 = RES_SMD_240_0805_1/8W_1%: RES SMD 240 OHM 1% 1/8W 0805; MFG: Yageo; Case/Package: 0805; MFG_PN: RC0805FR-13240RL; Supplier 1: DigiKey; Supplier Part Number 1: 13-RC0805FR-13240RLCT-ND; Unit Price: .1
R70 = RES_SMD_16K_0805_1/8W_1%: RES SMD 16K OHM 1% 1/8W 0805; MFG: Yageo; Case/Package: 0805; MFG_PN: RC0805FR-0716KL; Supplier 1: DigiKey; Supplier Part Number 1: 311-16.0KCRCT-ND; Unit Price: .1
R71 = RES_SMD_73.2K_0805_1/8W_1%: RES SMD 73.2K OHM 1% 1/8W 0805; MFG: Yageo; Case/Package: 0805; MFG_PN: RC0805FR-0773K2L; Supplier 1: DigiKey; Supplier Part Number 1: 311-73.2KCRCT-ND; Unit Price: .1
R73 = RES_SMD_26.7K_0805_1/8W_1%: RES SMD 26.7K OHM 1% 1/8W 0805; MFG: Yageo; Case/Package: 0805; MFG_PN: RC0805FR-0726K7L; Supplier 1: DigiKey; Supplier Part Number 1: 311-26.7KCRCT-ND; Unit Price: .1
U15 U16 = IC_COMPARATOR_MCP65R41T-1202E/CHY: IC COMPARATOR 1 W/VOLT REF SOT23; MFG: Microchip Technology; Unit Price: .53; Package/Case: SOT-23-6; Supplier 1: DigiKey; Supplier Part Number 1: MCP65R41T-1202E/CHYCT-ND; MFG_PN: MCP65R41T-1202E/CHY

## Nets that join several sheets
3V3: SoftCore_SA_P2_PG2 (16 pins), SoftCore_SA_P2_PG3 (16 pins), SoftCore_SA_P2_PG4 (18 pins), SoftCore_SA_P2_PG5 (6 pins), SoftCore_SA_P2_PG7 (C44.1 C46.1 U15.6 U16.6)
8V0: SoftCore_SA_P2_PG6 (6 pins), SoftCore_SA_P2_PG7 (R68.2)
GND: SoftCore_SA_P2_PG2 (28 pins), SoftCore_SA_P2_PG3 (15 pins), SoftCore_SA_P2_PG4 (22 pins), SoftCore_SA_P2_PG5 (17 pins), SoftCore_SA_P2_PG6 (23 pins), SoftCore_SA_P2_PG7 (14 pins)
VCC: SoftCore_SA_P2_PG5 (D3.2 R48.2 REL1.2), SoftCore_SA_P2_PG6 (J11.1 R65.1), SoftCore_SA_P2_PG7 (R71.2)
FSYNC: SoftCore_SA_P2_PG3 (J3.10), SoftCore_SA_P2_PG5 (U10.8)
NetC29_2: SoftCore_SA_P2_PG3 (J4.9), SoftCore_SA_P2_PG5 (C29.2 TP10.1)
NetJ1_1: SoftCore_SA_P2_PG2 (J1.1 U1.1 U2.1), SoftCore_SA_P2_PG5 (U10.7)
NetJ1_2: SoftCore_SA_P2_PG2 (J1.2 U1.2 U2.2), SoftCore_SA_P2_PG5 (U10.6)
NetJ1_7: SoftCore_SA_P2_PG2 (J1.7), SoftCore_SA_P2_PG5 (U11.1)
NetJ6_8: SoftCore_SA_P2_PG4 (J6.8), SoftCore_SA_P2_PG5 (Q1.1 R47.2)
NetR45_2: SoftCore_SA_P2_PG4 (R45.2 TP7.1), SoftCore_SA_P2_PG5 (R75.2 REL1.8)
NetR74_2: SoftCore_SA_P2_PG4 (R74.2), SoftCore_SA_P2_PG5 (U10.5)